# EAGLE schematic firetirs (EAGLE 7.7.0)

## Sheet 1 of 7
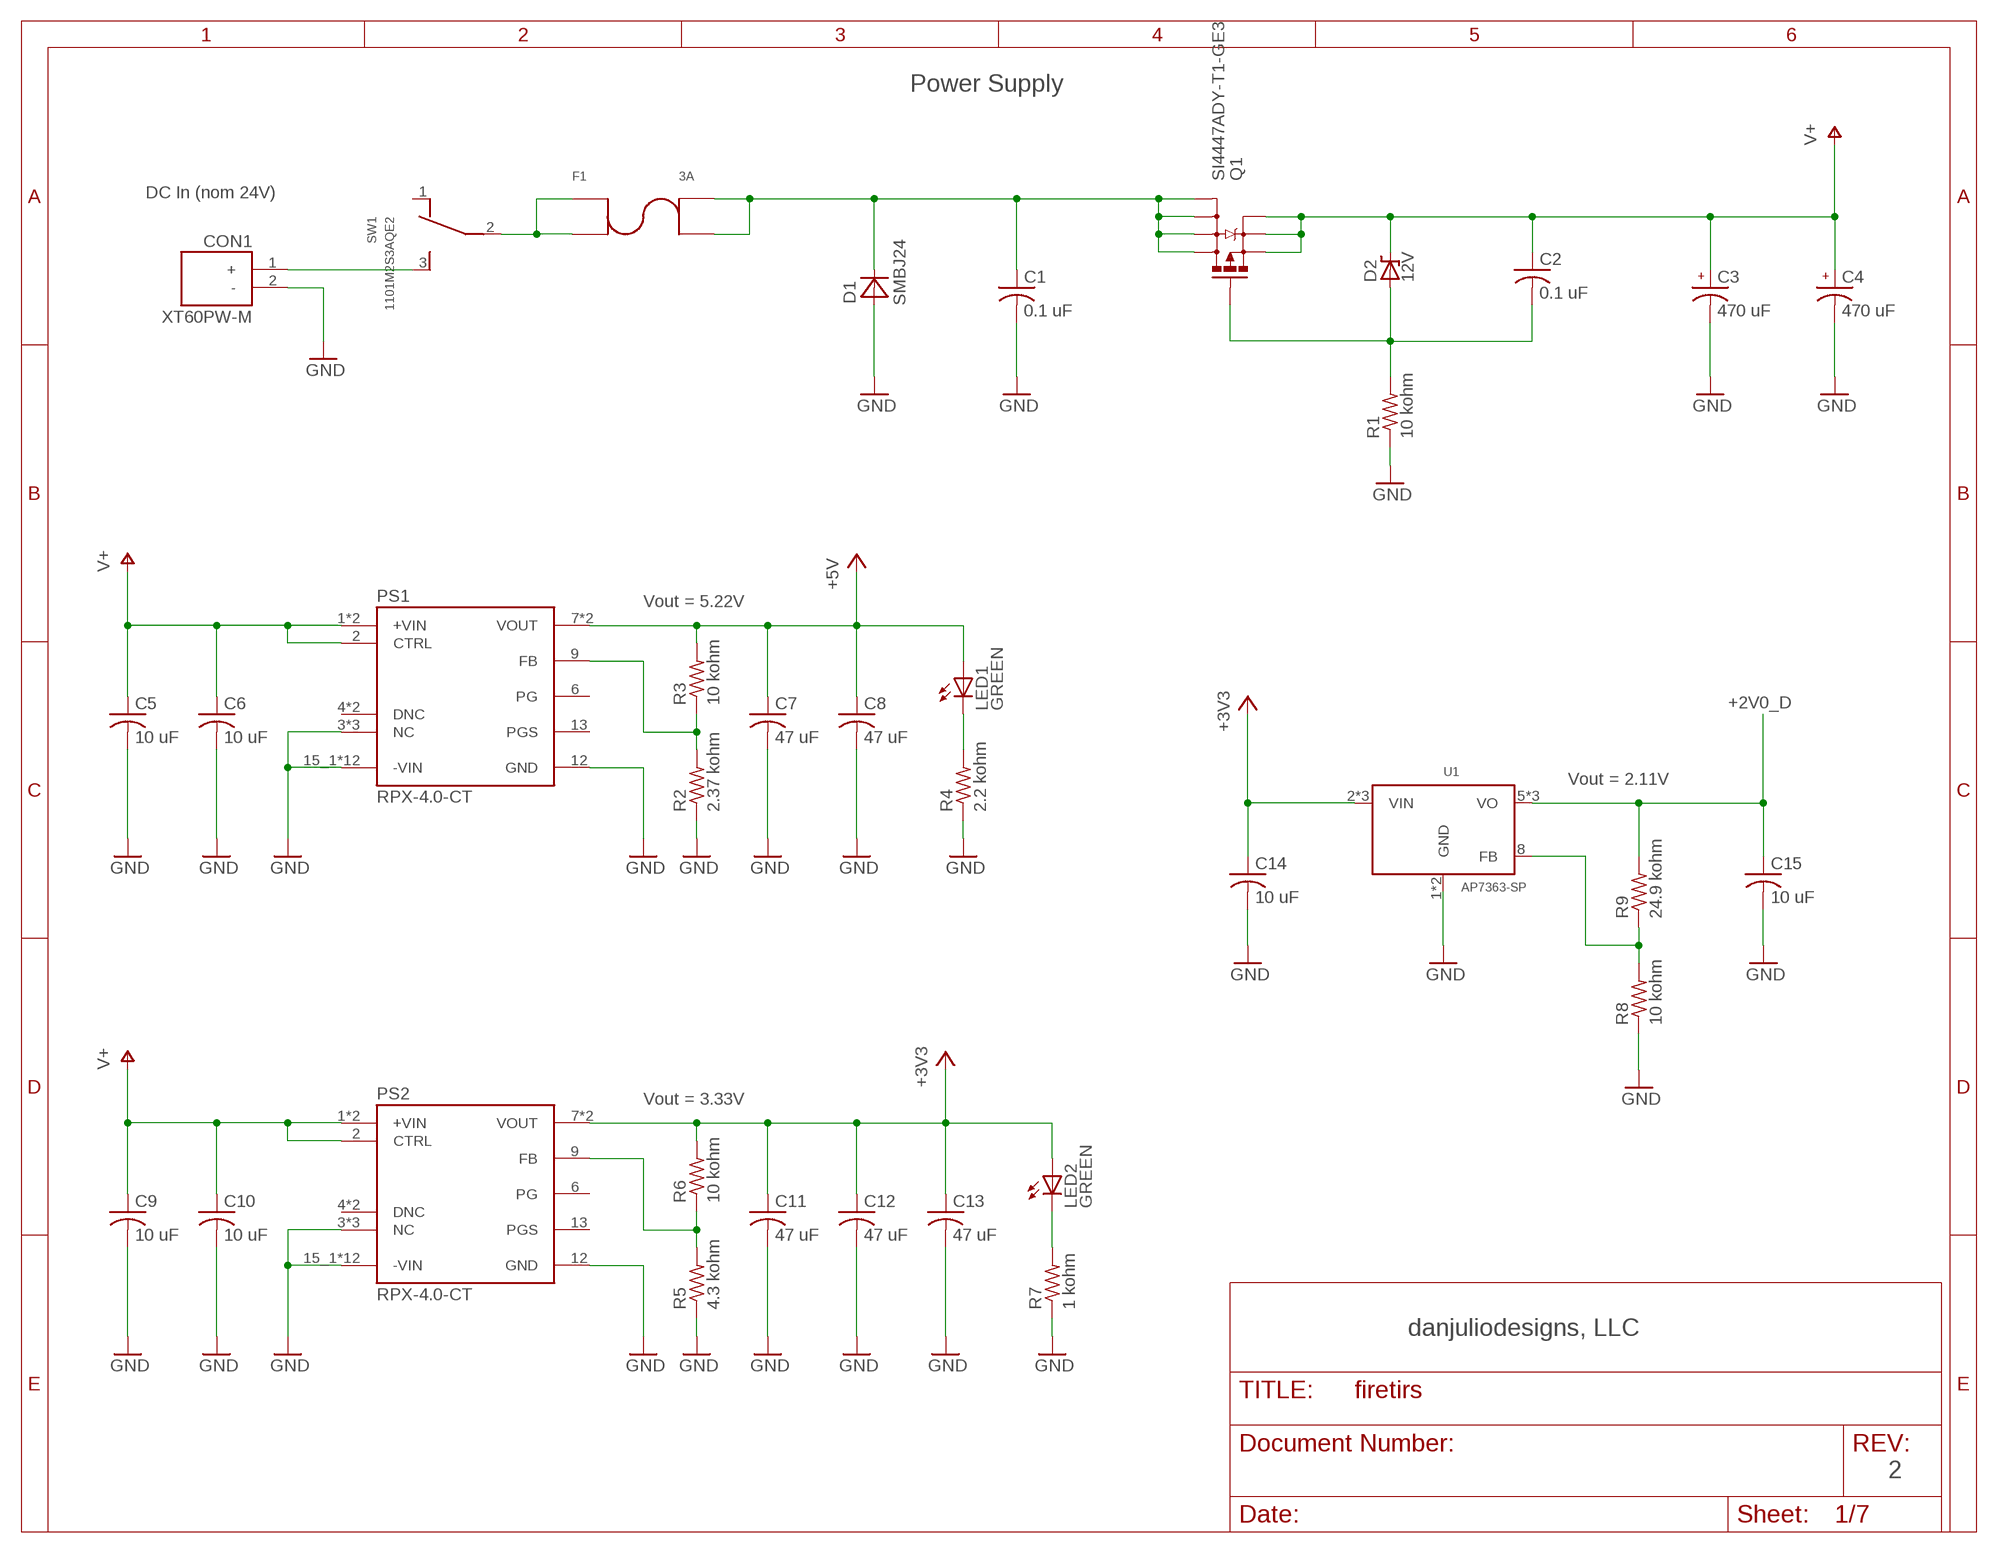
[diagram p0: schematic, sheet 1]

### Parts
C1  0.1 uF  C-USSMT0805  [C0805]
C2  0.1 uF  C-USSMT0805  [C0805]
C3  470 uF  CPOL-USSMT08X10  [ECAP-0810]
C4  470 uF  CPOL-USSMT08X10  [ECAP-0810]
C5  10 uF  C-USSMT0805  [C0805]
C6  10 uF  C-USSMT0805  [C0805]
C7  47 uF  C-USSMT0805  [C0805]
C8  47 uF  C-USSMT0805  [C0805]
C9  10 uF  C-USSMT0805  [C0805]
C10  10 uF  C-USSMT0805  [C0805]
C11  47 uF  C-USSMT0805  [C0805]
C12  47 uF  C-USSMT0805  [C0805]
C13  47 uF  C-USSMT0805  [C0805]
C14  10 uF  C-USSMT0603  [C0603]
C15  10 uF  C-USSMT0603  [C0603]
CON1  XT60PW-M  [AMASS_XT60PW-M]
D1  SMBJ24  DIODESMT214AA  [DO214AA]
D2  12V  ZENER_DIODESOD123  [SOD123]
F1  3A  FUSE_2IO5X20_SIDE  [FUSE_5_20_MM_SIDE]
LED1  GREEN  LEDCHIPLED_0603  [CHIPLED_0603]
LED2  GREEN  LEDCHIPLED_0603  [CHIPLED_0603]
PS1  RPX-4.0-CT  [CONV_RPX-4.0-CT]
PS2  RPX-4.0-CT  [CONV_RPX-4.0-CT]
Q1  SI4447ADY-T1-GE3  MOSFET_PCHANNEL_SO8SO8  [SO8]
R1  10 kohm  R-USSMT0603  [R0603]
R2  2.37 kohm  R-USSMT0603  [R0603]
R3  10 kohm  R-USSMT0603  [R0603]
R4  2.2 kohm  R-USSMT0603  [R0603]
R5  4.3 kohm  R-USSMT0603  [R0603]
R6  10 kohm  R-USSMT0603  [R0603]
R7  1 kohm  R-USSMT0603  [R0603]
R8  10 kohm  R-USSMT0603  [R0603]
R9  24.9 kohm  R-USSMT0603  [R0603]
SW1  1101M2S3AQE2  SPDTSIDE_TH_PWR  [SIDE_PWR_SPDT]
U1  AP7363-SP  AP7363SP  [SO8_PAD]

### Nets
+2V0_D: C15.1 R9.2 U1.5(VO) U1.6(VO) U1.7(VO) ; also sheet 4
+3V3: C11.1 C12.1 C13.1 C14.1 LED2.A PS2.7(VOUT) PS2.8(VOUT) R6.2 U1.2(VIN) U1.3(VIN) U1.4(VIN) ; also sheet 4,5,6,7
+5V: C7.1 C8.1 LED1.A PS1.7(VOUT) PS1.8(VOUT) R3.2 ; also sheet 2,3,7
GND: C1.2 C3.- C4.- C5.2 C6.2 C7.2 C8.2 C9.2 C10.2 C11.2 C12.2 C13.2 C14.2 C15.2 CON1.2(-) D1.A PS1.3(NC) PS1.10(NC) PS1.11(NC) PS1.12(GND) PS1.15_1(-VIN) PS1.15_2(-VIN) PS1.15_3(-VIN) PS1.15_4(-VIN) PS1.15_5(-VIN) PS1.15_6(-VIN) PS1.15_7(-VIN) PS1.15_8(-VIN) PS1.15_9(-VIN) PS1.15_10(-VIN) PS1.15_11(-VIN) PS1.15_12(-VIN) PS2.3(NC) PS2.10(NC) PS2.11(NC) PS2.12(GND) PS2.15_1(-VIN) PS2.15_2(-VIN) PS2.15_3(-VIN) PS2.15_4(-VIN) PS2.15_5(-VIN) PS2.15_6(-VIN) PS2.15_7(-VIN) PS2.15_8(-VIN) PS2.15_9(-VIN) PS2.15_10(-VIN) PS2.15_11(-VIN) PS2.15_12(-VIN) R1.1 R2.1 R4.1 R5.1 R7.1 R8.1 U1.1(GND) U1.PAD(GND) ; also sheet 2,3,4,5,6,7
N$1: CON1.1(+) SW1.3
N$2: F1.1A F1.1B SW1.2
N$3: C1.1 D1.C F1.2A F1.2B Q1.5(D1) Q1.6(D2) Q1.7(D3) Q1.8(D4)
N$4: C2.2 D2.A Q1.4(G) R1.2
N$5: LED1.C R4.2
N$6: LED2.C R7.2
N$7: PS1.9(FB) R2.2 R3.1
N$9: R8.2 R9.1 U1.8(FB)
N$10: PS2.9(FB) R5.2 R6.1
V+: C2.1 C3.+ C4.+ C5.1 C6.1 C9.1 C10.1 D2.C PS1.1(+VIN) PS1.2(CTRL) PS1.14(+VIN) PS2.1(+VIN) PS2.2(CTRL) PS2.14(+VIN) Q1.1(S1) Q1.2(S2) Q1.3(S3)
Unconnected: PS1.4(DNC) PS1.5(DNC) PS1.6(PG) PS1.13(PGS) PS2.4(DNC) PS2.5(DNC) PS2.6(PG) PS2.13(PGS) SW1.1

### Notes on the sheet
- Power Supply
- DC In (nom 24V)
- Vout = 5.22V
- Vout = 2.11V
- Vout = 3.33V
- danjuliodesigns, LLC
- 2

## Sheet 2 of 7
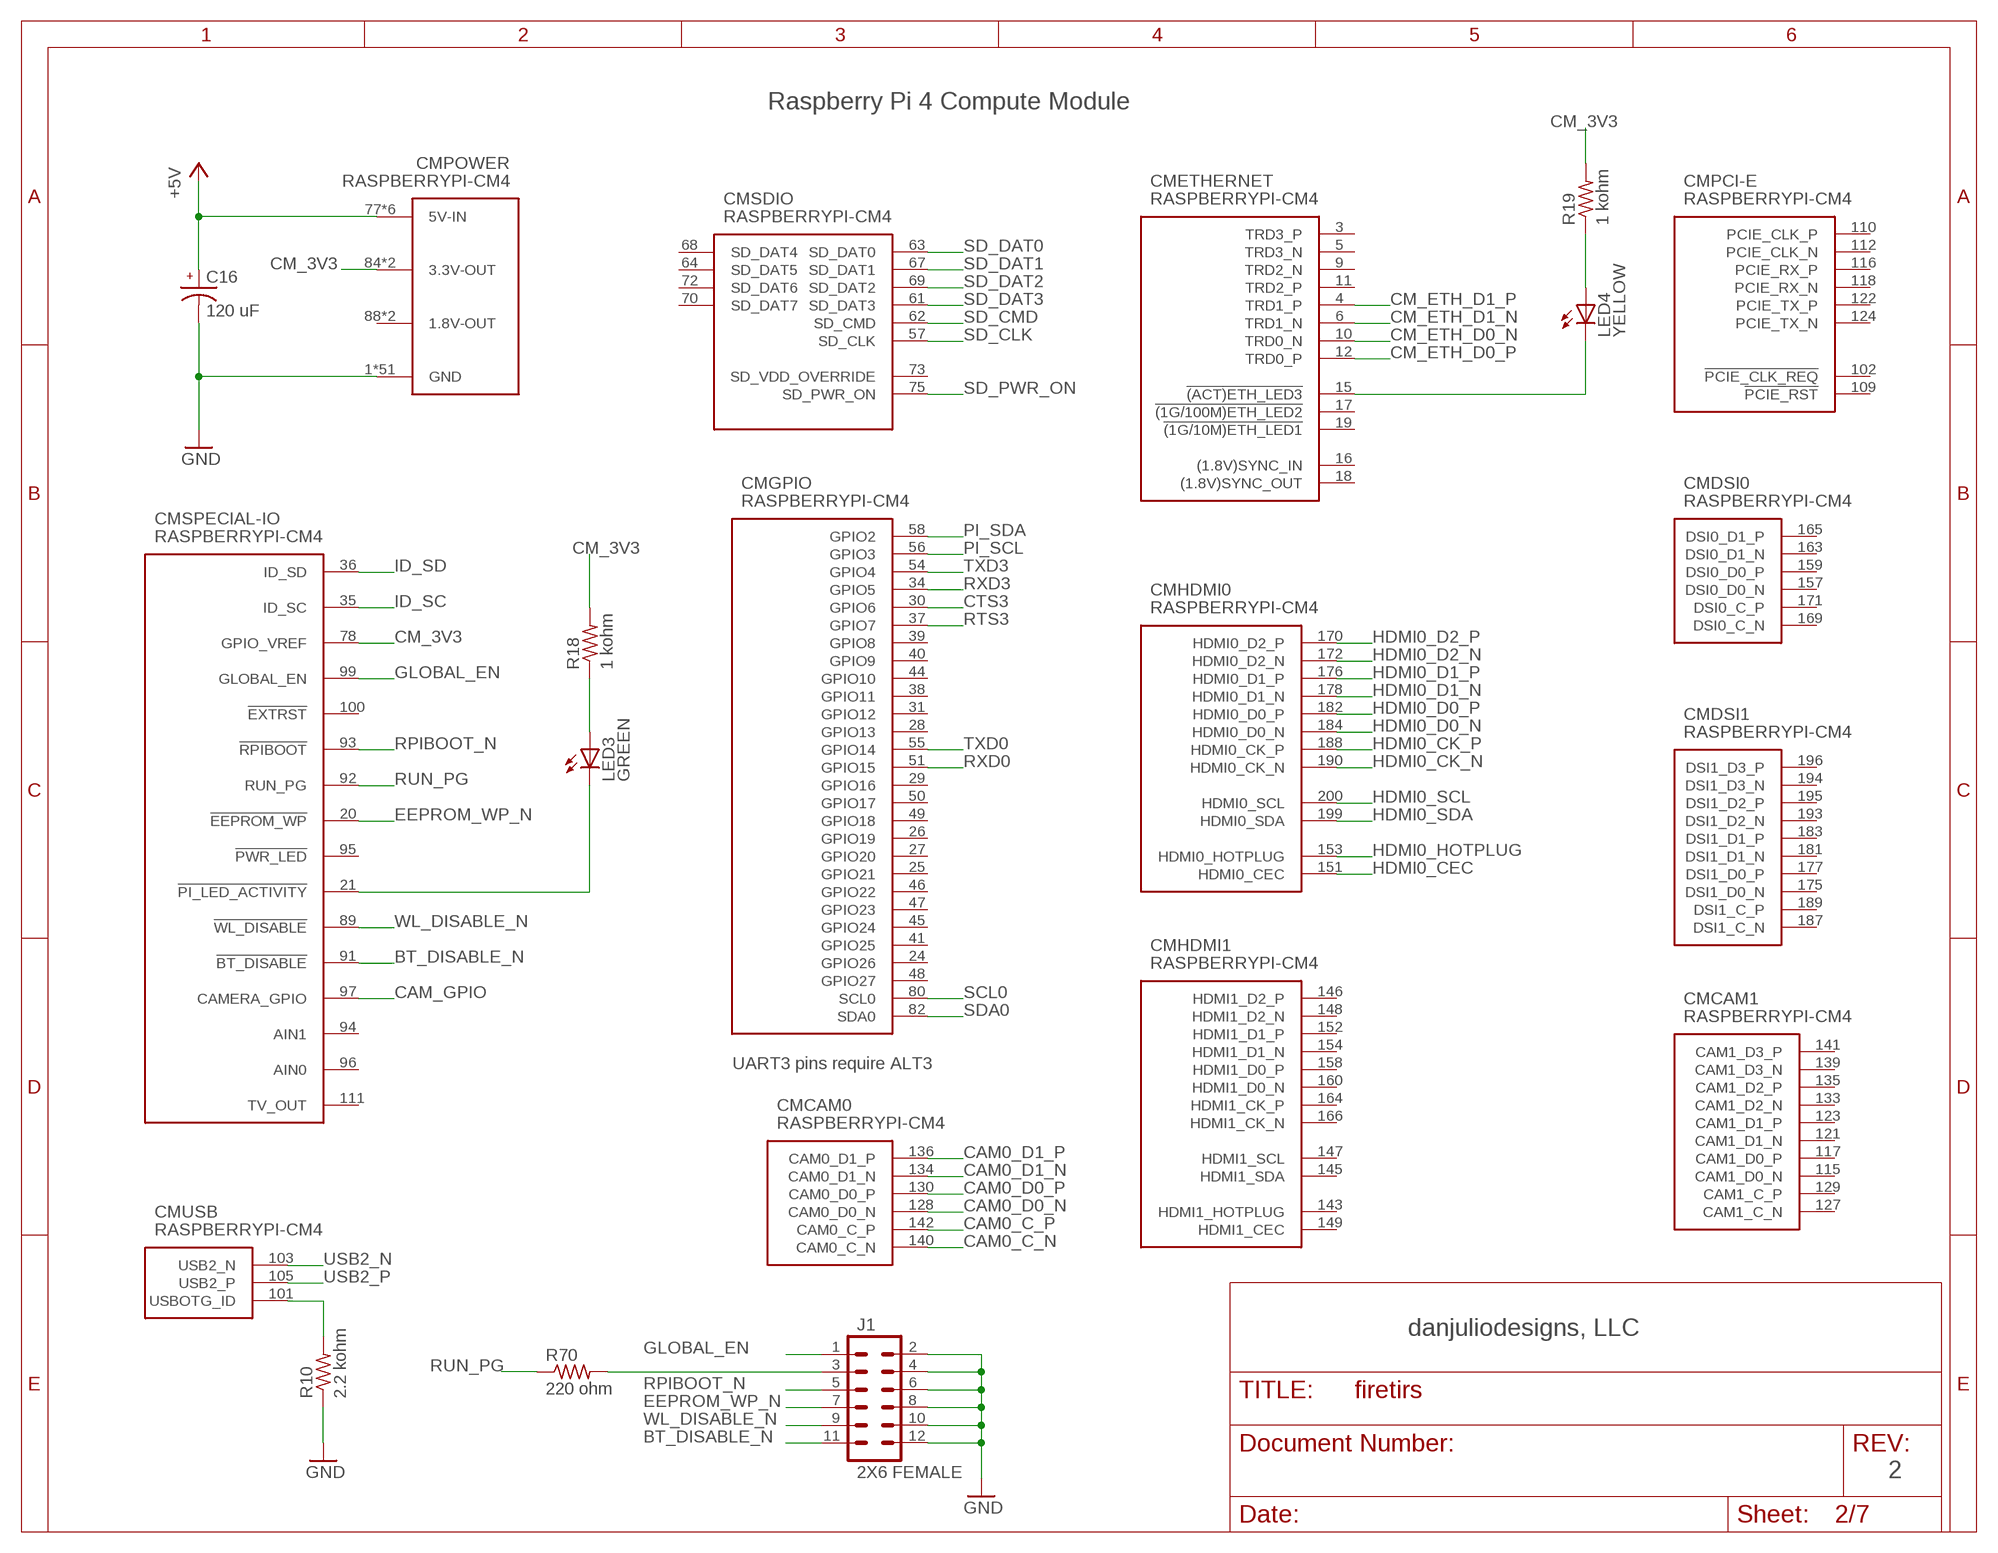
[diagram p1: schematic, sheet 2]

### Parts
C16  120 uF  CPOL-USSMT06X06  [ECAP-0606]
CM  RASPBERRYPI-CM4  [RASPBERRYPI-CM4]
J1  2X6 FEMALE  M06X2PTH_FEMALE  [2X6]
LED3  GREEN  LEDCHIPLED_0603  [CHIPLED_0603]
LED4  YELLOW  LEDCHIPLED_0603  [CHIPLED_0603]
R10  2.2 kohm  R-USSMT0603  [R0603]
R18  1 kohm  R-USSMT0603  [R0603]
R19  1 kohm  R-USSMT0603  [R0603]
R70  220 ohm  R-USSMT0603  [R0603]

### Nets
+5V: C16.+ CM.77(POWER:5V-IN) CM.79(POWER:5V-IN) CM.81(POWER:5V-IN) CM.83(POWER:5V-IN) CM.85(POWER:5V-IN) CM.87(POWER:5V-IN) ; also sheet 1,3,7
BT_DISABLE_N: CM.91(SPECIAL-IO:!BT_DISABLE) J1.11
CAM0_C_N: CM.140(CAM0:CAM0_C_N) ; also sheet 3
CAM0_C_P: CM.142(CAM0:CAM0_C_P) ; also sheet 3
CAM0_D0_N: CM.128(CAM0:CAM0_D0_N) ; also sheet 3
CAM0_D0_P: CM.130(CAM0:CAM0_D0_P) ; also sheet 3
CAM0_D1_N: CM.134(CAM0:CAM0_D1_N) ; also sheet 3
CAM0_D1_P: CM.136(CAM0:CAM0_D1_P) ; also sheet 3
CAM_GPIO: CM.97(SPECIAL-IO:CAMERA_GPIO) ; also sheet 3
CM_3V3: CM.78(SPECIAL-IO:GPIO_VREF) CM.84(POWER:3.3V-OUT) CM.86(POWER:3.3V-OUT) R18.2 R19.2 ; also sheet 3
CM_ETH_D0_N: CM.10(ETHERNET:TRD0_N) ; also sheet 7
CM_ETH_D0_P: CM.12(ETHERNET:TRD0_P) ; also sheet 7
CM_ETH_D1_N: CM.6(ETHERNET:TRD1_N) ; also sheet 7
CM_ETH_D1_P: CM.4(ETHERNET:TRD1_P) ; also sheet 7
CTS3: CM.30(GPIO:GPIO6) ; also sheet 3
EEPROM_WP_N: CM.20(SPECIAL-IO:!EEPROM_WP) J1.7
GLOBAL_EN: CM.99(SPECIAL-IO:GLOBAL_EN) J1.1
GND: C16.- CM.1(POWER:GND) CM.2(POWER:GND) CM.7(POWER:GND) CM.8(POWER:GND) CM.13(POWER:GND) CM.14(POWER:GND) CM.22(POWER:GND) CM.23(POWER:GND) CM.32(POWER:GND) CM.33(POWER:GND) CM.42(POWER:GND) CM.43(POWER:GND) CM.52(POWER:GND) CM.53(POWER:GND) CM.59(POWER:GND) CM.60(POWER:GND) CM.65(POWER:GND) CM.66(POWER:GND) CM.71(POWER:GND) CM.74(POWER:GND) CM.98(POWER:GND) CM.107(POWER:GND) CM.108(POWER:GND) CM.113(POWER:GND) CM.114(POWER:GND) CM.119(POWER:GND) CM.120(POWER:GND) CM.125(POWER:GND) CM.126(POWER:GND) CM.131(POWER:GND) CM.132(POWER:GND) CM.137(POWER:GND) CM.138(POWER:GND) CM.144(POWER:GND) CM.150(POWER:GND) CM.155(POWER:GND) CM.156(POWER:GND) CM.161(POWER:GND) CM.162(POWER:GND) CM.167(POWER:GND) CM.168(POWER:GND) CM.173(POWER:GND) CM.174(POWER:GND) CM.179(POWER:GND) CM.180(POWER:GND) CM.185(POWER:GND) CM.186(POWER:GND) CM.191(POWER:GND) CM.192(POWER:GND) CM.197(POWER:GND) CM.198(POWER:GND) J1.2 J1.4 J1.6 J1.8 J1.10 J1.12 R10.1 ; also sheet 1,3,4,5,6,7
HDMI0_CEC: CM.151(HDMI0:HDMI0_CEC) ; also sheet 3
HDMI0_CK_N: CM.190(HDMI0:HDMI0_CK_N) ; also sheet 3
HDMI0_CK_P: CM.188(HDMI0:HDMI0_CK_P) ; also sheet 3
HDMI0_D0_N: CM.184(HDMI0:HDMI0_D0_N) ; also sheet 3
HDMI0_D0_P: CM.182(HDMI0:HDMI0_D0_P) ; also sheet 3
HDMI0_D1_N: CM.178(HDMI0:HDMI0_D1_N) ; also sheet 3
HDMI0_D1_P: CM.176(HDMI0:HDMI0_D1_P) ; also sheet 3
HDMI0_D2_N: CM.172(HDMI0:HDMI0_D2_N) ; also sheet 3
HDMI0_D2_P: CM.170(HDMI0:HDMI0_D2_P) ; also sheet 3
HDMI0_HOTPLUG: CM.153(HDMI0:HDMI0_HOTPLUG) ; also sheet 3
HDMI0_SCL: CM.200(HDMI0:HDMI0_SCL) ; also sheet 3
HDMI0_SDA: CM.199(HDMI0:HDMI0_SDA) ; also sheet 3
ID_SC: CM.35(SPECIAL-IO:ID_SC) ; also sheet 3
ID_SD: CM.36(SPECIAL-IO:ID_SD) ; also sheet 3
N$8: CM.101(USB:USBOTG_ID) R10.2
N$16: CM.21(SPECIAL-IO:!PI_LED_ACTIVITY) LED3.C
N$19: LED3.A R18.1
N$21: CM.15(ETHERNET:!(ACT)ETH_LED3) LED4.C
N$22: LED4.A R19.1
N$35: J1.3 R70.2
PI_SCL: CM.56(GPIO:GPIO3) ; also sheet 3
PI_SDA: CM.58(GPIO:GPIO2) ; also sheet 3
RPIBOOT_N: CM.93(SPECIAL-IO:!RPIBOOT) J1.5
RTS3: CM.37(GPIO:GPIO7) ; also sheet 3
RUN_PG: CM.92(SPECIAL-IO:RUN_PG) R70.1
RXD0: CM.51(GPIO:GPIO15) ; also sheet 3
RXD3: CM.34(GPIO:GPIO5) ; also sheet 3
SCL0: CM.80(GPIO:SCL0) ; also sheet 3
SD_CLK: CM.57(SDIO:SD_CLK) ; also sheet 3
SD_CMD: CM.62(SDIO:SD_CMD) ; also sheet 3
SD_DAT0: CM.63(SDIO:SD_DAT0) ; also sheet 3
SD_DAT1: CM.67(SDIO:SD_DAT1) ; also sheet 3
SD_DAT2: CM.69(SDIO:SD_DAT2) ; also sheet 3
SD_DAT3: CM.61(SDIO:SD_DAT3) ; also sheet 3
SD_PWR_ON: CM.75(SDIO:SD_PWR_ON) ; also sheet 3
SDA0: CM.82(GPIO:SDA0) ; also sheet 3
TXD0: CM.55(GPIO:GPIO14) ; also sheet 3
TXD3: CM.54(GPIO:GPIO4) ; also sheet 3
USB2_N: CM.103(USB:USB2_N) ; also sheet 3
USB2_P: CM.105(USB:USB2_P) ; also sheet 3
WL_DISABLE_N: CM.89(SPECIAL-IO:!WL_DISABLE) J1.9
Unconnected: CM.3(ETHERNET:TRD3_P) CM.5(ETHERNET:TRD3_N) CM.9(ETHERNET:TRD2_N) CM.11(ETHERNET:TRD2_P) CM.16(ETHERNET:(1.8V)SYNC_IN) CM.17(ETHERNET:!(1G/100M)ETH_LED2) CM.18(ETHERNET:(1.8V)SYNC_OUT) CM.19(ETHERNET:!(1G/10M)ETH_LED1) CM.24(GPIO:GPIO26) CM.25(GPIO:GPIO21) CM.26(GPIO:GPIO19) CM.27(GPIO:GPIO20) CM.28(GPIO:GPIO13) CM.29(GPIO:GPIO16) CM.31(GPIO:GPIO12) CM.38(GPIO:GPIO11) CM.39(GPIO:GPIO8) CM.40(GPIO:GPIO9) CM.41(GPIO:GPIO25) CM.44(GPIO:GPIO10) CM.45(GPIO:GPIO24) CM.46(GPIO:GPIO22) CM.47(GPIO:GPIO23) CM.48(GPIO:GPIO27) CM.49(GPIO:GPIO18) CM.50(GPIO:GPIO17) CM.64(SDIO:SD_DAT5) CM.68(SDIO:SD_DAT4) CM.70(SDIO:SD_DAT7) CM.72(SDIO:SD_DAT6) CM.73(SDIO:SD_VDD_OVERRIDE) CM.94(SPECIAL-IO:AIN1) CM.95(SPECIAL-IO:!PWR_LED) CM.96(SPECIAL-IO:AIN0) CM.100(SPECIAL-IO:!EXTRST) CM.102(PCI-E:!PCIE_CLK_REQ) CM.109(PCI-E:!PCIE_RST) CM.110(PCI-E:PCIE_CLK_P) CM.111(SPECIAL-IO:TV_OUT) CM.112(PCI-E:PCIE_CLK_N) CM.115(CAM1:CAM1_D0_N) CM.116(PCI-E:PCIE_RX_P) CM.117(CAM1:CAM1_D0_P) CM.118(PCI-E:PCIE_RX_N) CM.121(CAM1:CAM1_D1_N) CM.122(PCI-E:PCIE_TX_P) CM.123(CAM1:CAM1_D1_P) CM.124(PCI-E:PCIE_TX_N) CM.127(CAM1:CAM1_C_N) CM.129(CAM1:CAM1_C_P) CM.133(CAM1:CAM1_D2_N) CM.135(CAM1:CAM1_D2_P) CM.139(CAM1:CAM1_D3_N) CM.141(CAM1:CAM1_D3_P) CM.143(HDMI1:HDMI1_HOTPLUG) CM.145(HDMI1:HDMI1_SDA) CM.146(HDMI1:HDMI1_D2_P) CM.147(HDMI1:HDMI1_SCL) CM.148(HDMI1:HDMI1_D2_N) CM.149(HDMI1:HDMI1_CEC) CM.152(HDMI1:HDMI1_D1_P) CM.154(HDMI1:HDMI1_D1_N) CM.157(DSI0:DSI0_D0_N) CM.158(HDMI1:HDMI1_D0_P) CM.159(DSI0:DSI0_D0_P) CM.160(HDMI1:HDMI1_D0_N) CM.163(DSI0:DSI0_D1_N) CM.164(HDMI1:HDMI1_CK_P) CM.165(DSI0:DSI0_D1_P) CM.166(HDMI1:HDMI1_CK_N) CM.169(DSI0:DSI0_C_N) CM.171(DSI0:DSI0_C_P) CM.175(DSI1:DSI1_D0_N) CM.177(DSI1:DSI1_D0_P) CM.181(DSI1:DSI1_D1_N) CM.183(DSI1:DSI1_D1_P) CM.187(DSI1:DSI1_C_N) CM.189(DSI1:DSI1_C_P) CM.193(DSI1:DSI1_D2_N) CM.194(DSI1:DSI1_D3_N) CM.195(DSI1:DSI1_D2_P) CM.196(DSI1:DSI1_D3_P)

### Notes on the sheet
- Raspberry Pi 4 Compute Module
- UART3 pins require ALT3
- danjuliodesigns, LLC
- 2

## Sheet 3 of 7
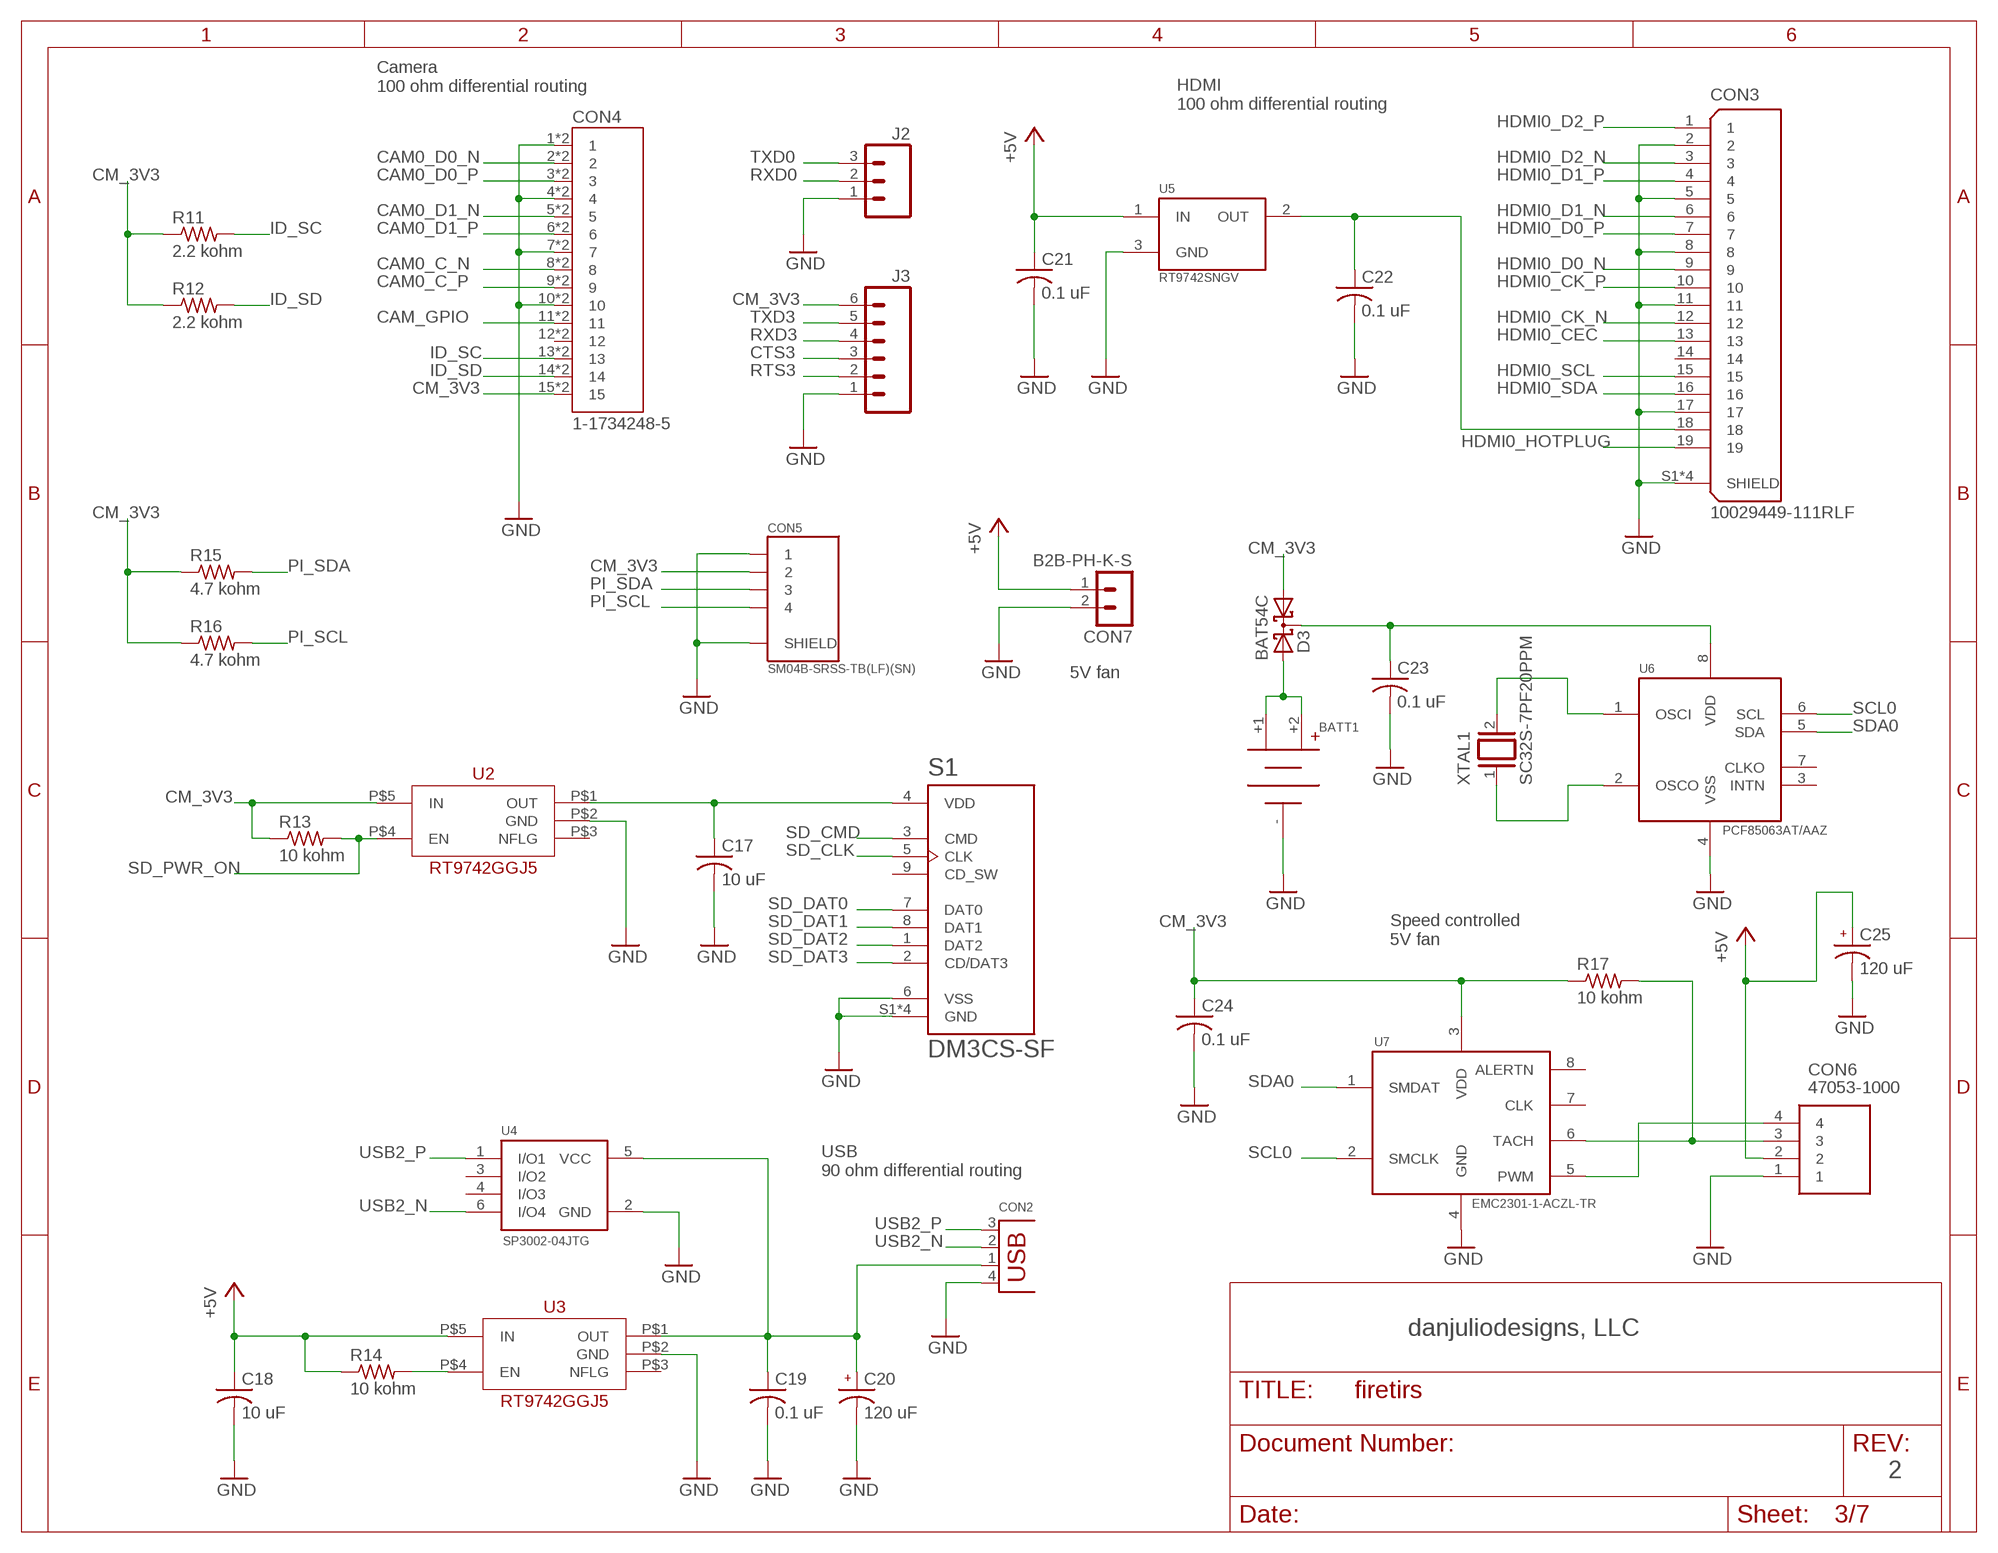
[diagram p2: schematic, sheet 3]

### Parts
BATT1  COIN_CELL12MM  [KEYSTONE_3001]
C17  10 uF  C-USSMT0603  [C0603]
C18  10 uF  C-USSMT0603  [C0603]
C19  0.1 uF  C-USSMT0603  [C0603]
C20  120 uF  CPOL-USSMT06X06  [ECAP-0606]
C21  0.1 uF  C-USSMT0603  [C0603]
C22  0.1 uF  C-USSMT0603  [C0603]
C23  0.1 uF  C-USSMT0603  [C0603]
C24  0.1 uF  C-USSMT0603  [C0603]
C25  120 uF  CPOL-USSMT06X06  [ECAP-0606]
CON2  USBFCI_87520  [FCI_87520]
CON3  10029449-111RLF  [AMPHENOL_10029449-111RLF]
CON4  1-1734248-5  [TE_1-1734248-5]
CON5  SM04B-SRSS-TB(LF)(SN)  [JST_SM04B-SRSS-TB(LF)(SN)]
CON6  47053-1000  [470531000]
CON7  B2B-PH-K-S  [B2B-PH-K-S]
D3  BAT54C  [SOT23]
J2  M03PTH  [1X03]
J3  M06SILK_FEMALE_PTH  [1X06]
R11  2.2 kohm  R-USSMT0603  [R0603]
R12  2.2 kohm  R-USSMT0603  [R0603]
R13  10 kohm  R-USSMT0603  [R0603]
R14  10 kohm  R-USSMT0603  [R0603]
R15  4.7 kohm  R-USSMT0603  [R0603]
R16  4.7 kohm  R-USSMT0603  [R0603]
R17  10 kohm  R-USSMT0603  [R0603]
S1  DM3CS-SF  [HRS_DM3CS-SF]
U2  RT9742GGJ5  [TSOT-23-5]
U3  RT9742GGJ5  [TSOT-23-5]
U4  SP3002-04JTG  [SOT65P220X95-6N]
U5  RT9742SNGV  RT9742_3TERMGV  [SOT23-3]
U6  PCF85063AT/AAZ  PCF85063AT  [SO8]
U7  EMC2301-1-ACZL-TR  EMC2301  [MSOP8]
XTAL1  SC32S-7PF20PPM  CRYSTAL3.2X1.5  [CRYSTAL-3215]

### Nets
+5V: C18.1 C21.1 C25.+ CON6.2 CON7.1 R14.1 U3.P$5(IN) U5.1(IN) ; also sheet 1,2,7
CAM0_C_N: CON4.8 CON4.8_1 ; also sheet 2
CAM0_C_P: CON4.9 CON4.9_1 ; also sheet 2
CAM0_D0_N: CON4.2 CON4.2_1 ; also sheet 2
CAM0_D0_P: CON4.3 CON4.3_1 ; also sheet 2
CAM0_D1_N: CON4.5 CON4.5_1 ; also sheet 2
CAM0_D1_P: CON4.6 CON4.6_1 ; also sheet 2
CAM_GPIO: CON4.11 CON4.11_1 ; also sheet 2
CM_3V3: C24.1 CON4.15 CON4.15_1 CON5.2 D3.1(A1) J3.6 R11.1 R12.1 R13.1 R15.1 R16.1 R17.1 U2.P$5(IN) U7.3(VDD) ; also sheet 2
CTS3: J3.3 ; also sheet 2
GND: BATT1.- C17.2 C18.2 C19.2 C20.- C21.2 C22.2 C23.2 C24.2 C25.- CON2.4(GND) CON3.2 CON3.5 CON3.8 CON3.11 CON3.17 CON3.S1(SHIELD) CON3.S2(SHIELD) CON3.S3(SHIELD) CON3.S4(SHIELD) CON4.1 CON4.1_1 CON4.4 CON4.4_1 CON4.7 CON4.7_1 CON4.10 CON4.10_1 CON5.1 CON5.S1(SHIELD) CON5.S2(SHIELD) CON6.1 CON7.2 J2.1 J3.1 S1.6(VSS) S1.S1(GND) S1.S2(GND) S1.S3(GND) S1.S5(GND) U2.P$2(GND) U3.P$2(GND) U4.2(GND) U5.3(GND) U6.4(VSS) U7.4(GND) ; also sheet 1,2,4,5,6,7
HDMI0_CEC: CON3.13 ; also sheet 2
HDMI0_CK_N: CON3.12 ; also sheet 2
HDMI0_CK_P: CON3.10 ; also sheet 2
HDMI0_D0_N: CON3.9 ; also sheet 2
HDMI0_D0_P: CON3.7 ; also sheet 2
HDMI0_D1_N: CON3.6 ; also sheet 2
HDMI0_D1_P: CON3.4 ; also sheet 2
HDMI0_D2_N: CON3.3 ; also sheet 2
HDMI0_D2_P: CON3.1 ; also sheet 2
HDMI0_HOTPLUG: CON3.19 ; also sheet 2
HDMI0_SCL: CON3.15 ; also sheet 2
HDMI0_SDA: CON3.16 ; also sheet 2
ID_SC: CON4.13 CON4.13_1 R11.2 ; also sheet 2
ID_SD: CON4.14 CON4.14_1 R12.2 ; also sheet 2
N$11: C17.1 S1.4(VDD) U2.P$1(OUT)
N$12: C19.1 C20.+ CON2.1(VBUS) U3.P$1(OUT) U4.5(VCC)
N$13: U6.2(OSCO) XTAL1.1
N$14: BATT1.+1 BATT1.+2 D3.2(A2)
N$15: U6.1(OSCI) XTAL1.2
N$17: CON6.3 R17.2 U7.6(TACH)
N$18: CON6.4 U7.5(PWM)
N$20: R14.2 U3.P$4(EN)
OUT: C22.1 CON3.18 U5.2(OUT)
PI_SCL: CON5.4 R16.2 ; also sheet 2
PI_SDA: CON5.3 R15.2 ; also sheet 2
RTS3: J3.2 ; also sheet 2
RXD0: J2.2 ; also sheet 2
RXD3: J3.4 ; also sheet 2
SCL0: U6.6(SCL) U7.2(SMCLK) ; also sheet 2
SD_CLK: S1.5(CLK) ; also sheet 2
SD_CMD: S1.3(CMD) ; also sheet 2
SD_DAT0: S1.7(DAT0) ; also sheet 2
SD_DAT1: S1.8(DAT1) ; also sheet 2
SD_DAT2: S1.1(DAT2) ; also sheet 2
SD_DAT3: S1.2(CD/DAT3) ; also sheet 2
SD_PWR_ON: R13.2 U2.P$4(EN) ; also sheet 2
SDA0: U6.5(SDA) U7.1(SMDAT) ; also sheet 2
TXD0: J2.3 ; also sheet 2
TXD3: J3.5 ; also sheet 2
USB2_N: CON2.2(D-) U4.6(I/O4) ; also sheet 2
USB2_P: CON2.3(D+) U4.1(I/O1) ; also sheet 2
VDD: C23.1 D3.3(CC) U6.8(VDD)
Unconnected: CON3.14 CON4.12 CON4.12_1 S1.9(CD_SW) U2.P$3(NFLG) U3.P$3(NFLG) U4.3(I/O2) U4.4(I/O3) U6.3(INTN) U6.7(CLKO) U7.7(CLK) U7.8(ALERTN)

### Notes on the sheet
- Camera
  100 ohm differential routing
- HDMI
  100 ohm differential routing
- 5V fan
- Speed controlled
  5V fan
- USB
  90 ohm differential routing
- danjuliodesigns, LLC
- 2

## Sheet 4 of 7
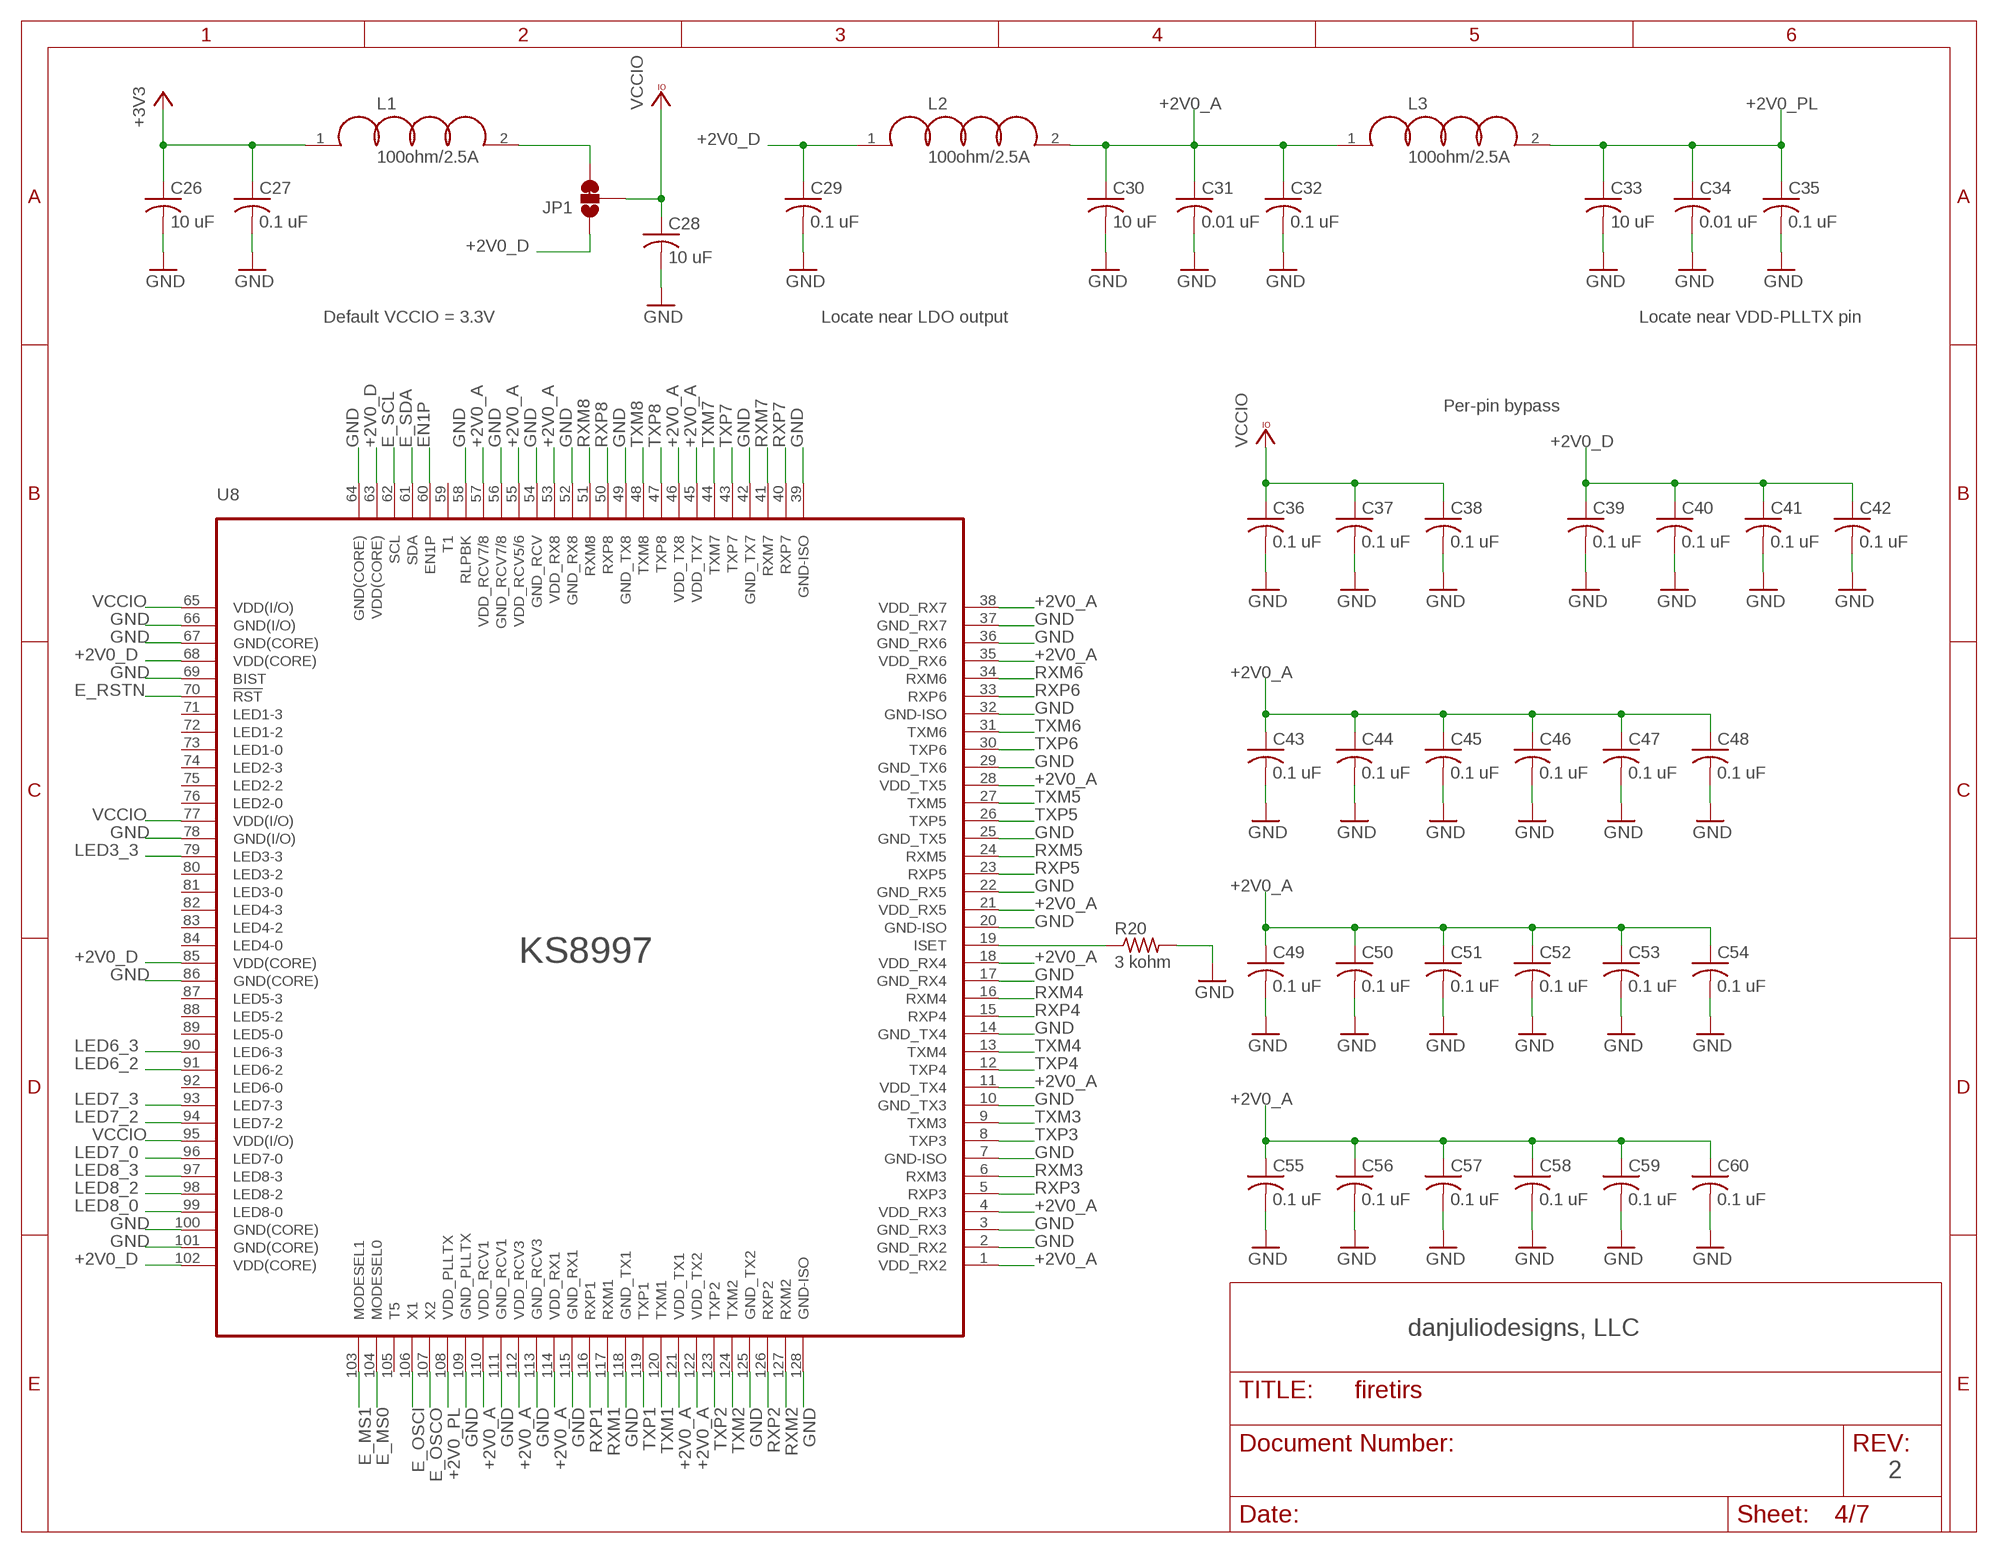
[diagram p3: schematic, sheet 4]

### Parts
C26  10 uF  C-USSMT0603  [C0603]
C27  0.1 uF  C-USSMT0603  [C0603]
C28  10 uF  C-USSMT0603  [C0603]
C29  0.1 uF  C-USSMT0603  [C0603]
C30  10 uF  C-USSMT0603  [C0603]
C31  0.01 uF  C-USSMT0603  [C0603]
C32  0.1 uF  C-USSMT0603  [C0603]
C33  10 uF  C-USSMT0603  [C0603]
C34  0.01 uF  C-USSMT0603  [C0603]
C35  0.1 uF  C-USSMT0603  [C0603]
C36  0.1 uF  C-USSMT0603  [C0603]
C37  0.1 uF  C-USSMT0603  [C0603]
C38  0.1 uF  C-USSMT0603  [C0603]
C39  0.1 uF  C-USSMT0603  [C0603]
C40  0.1 uF  C-USSMT0603  [C0603]
C41  0.1 uF  C-USSMT0603  [C0603]
C42  0.1 uF  C-USSMT0603  [C0603]
C43  0.1 uF  C-USSMT0603  [C0603]
C44  0.1 uF  C-USSMT0603  [C0603]
C45  0.1 uF  C-USSMT0603  [C0603]
C46  0.1 uF  C-USSMT0603  [C0603]
C47  0.1 uF  C-USSMT0603  [C0603]
C48  0.1 uF  C-USSMT0603  [C0603]
C49  0.1 uF  C-USSMT0603  [C0603]
C50  0.1 uF  C-USSMT0603  [C0603]
C51  0.1 uF  C-USSMT0603  [C0603]
C52  0.1 uF  C-USSMT0603  [C0603]
C53  0.1 uF  C-USSMT0603  [C0603]
C54  0.1 uF  C-USSMT0603  [C0603]
C55  0.1 uF  C-USSMT0603  [C0603]
C56  0.1 uF  C-USSMT0603  [C0603]
C57  0.1 uF  C-USSMT0603  [C0603]
C58  0.1 uF  C-USSMT0603  [C0603]
C59  0.1 uF  C-USSMT0603  [C0603]
C60  0.1 uF  C-USSMT0603  [C0603]
JP1  JUMPER-PAD-3-2OF3_NC_BY_TRACE_SMALL  [PAD-JUMPER-3-2OF3_NC_BY_TRACE_YES_SILK_FULL_BOX]
L1  100ohm/2.5A  INDUCTORSMT0603  [L0603]
L2  100ohm/2.5A  INDUCTORSMT0603  [L0603]
L3  100ohm/2.5A  INDUCTORSMT0603  [L0603]
R20  3 kohm  R-USSMT0603  [R0603]
U8  KS8997  [PQFP128-PQ]

### Nets
+2V0_A: C30.1 C31.1 C32.1 C43.1 C44.1 C45.1 C46.1 C47.1 C48.1 C49.1 C50.1 C51.1 C52.1 C53.1 C54.1 C55.1 C56.1 C57.1 C58.1 C59.1 C60.1 L2.2 L3.1 U8.1(VDD_RX2) U8.4(VDD_RX3) U8.11(VDD_TX4) U8.18(VDD_RX4) U8.21(VDD_RX5) U8.28(VDD_TX5) U8.35(VDD_RX6) U8.38(VDD_RX7) U8.45(VDD_TX7) U8.46(VDD_TX8) U8.53(VDD_RX8) U8.55(VDD_RCV5/6) U8.57(VDD_RCV7/8) U8.110(VDD_RCV1) U8.112(VDD_RCV3) U8.114(VDD_RX1) U8.121(VDD_TX1) U8.122(VDD_TX2) ; also sheet 6,7
+2V0_D: C29.1 C39.1 C40.1 C41.1 C42.1 JP1.1 L2.1 U8.63(VDD(CORE)) U8.68(VDD(CORE)) U8.85(VDD(CORE)) U8.102(VDD(CORE)) ; also sheet 1
+2V0_PL: C33.1 C34.1 C35.1 L3.2 U8.108(VDD_PLLTX)
+3V3: C26.1 C27.1 L1.1 ; also sheet 1,5,6,7
E_MS0: U8.104(MODESEL0) ; also sheet 5
E_MS1: U8.103(MODESEL1) ; also sheet 5
E_OSCI: U8.106(X1) ; also sheet 5
E_OSCO: U8.107(X2) ; also sheet 5
E_RSTN: U8.70(!RST!) ; also sheet 5
E_SCL: U8.62(SCL) ; also sheet 5
E_SDA: U8.61(SDA) ; also sheet 5
EN1P: U8.60(EN1P) ; also sheet 5
GND: C26.2 C27.2 C28.2 C29.2 C30.2 C31.2 C32.2 C33.2 C34.2 C35.2 C36.2 C37.2 C38.2 C39.2 C40.2 C41.2 C42.2 C43.2 C44.2 C45.2 C46.2 C47.2 C48.2 C49.2 C50.2 C51.2 C52.2 C53.2 C54.2 C55.2 C56.2 C57.2 C58.2 C59.2 C60.2 R20.2 U8.2(GND_RX2) U8.3(GND_RX3) U8.7(GND-ISO) U8.10(GND_TX3) U8.14(GND_TX4) U8.17(GND_RX4) U8.20(GND-ISO) U8.22(GND_RX5) U8.25(GND_TX5) U8.29(GND_TX6) U8.32(GND-ISO) U8.36(GND_RX6) U8.37(GND_RX7) U8.39(GND-ISO) U8.42(GND_TX7) U8.49(GND_TX8) U8.52(GND_RX8) U8.54(GND_RCV) U8.56(GND_RCV7/8) U8.58(RLPBK) U8.64(GND(CORE)) U8.66(GND(I/O)) U8.67(GND(CORE)) U8.69(BIST) U8.78(GND(I/O)) U8.86(GND(CORE)) U8.100(GND(CORE)) U8.101(GND(CORE)) U8.109(GND_PLLTX) U8.111(GND_RCV1) U8.113(GND_RCV3) U8.115(GND_RX1) U8.118(GND_TX1) U8.125(GND_TX2) U8.128(GND-ISO) ; also sheet 1,2,3,5,6,7
ISET: R20.1 U8.19(ISET)
LED3_3: U8.79(LED3-3) ; also sheet 5
LED6_2: U8.91(LED6-2) ; also sheet 5
LED6_3: U8.90(LED6-3) ; also sheet 5
LED7_0: U8.96(LED7-0) ; also sheet 5
LED7_2: U8.94(LED7-2) ; also sheet 5
LED7_3: U8.93(LED7-3) ; also sheet 5
LED8_0: U8.99(LED8-0) ; also sheet 5
LED8_2: U8.98(LED8-2) ; also sheet 5
LED8_3: U8.97(LED8-3) ; also sheet 5
N$24: JP1.3 L1.2
RXM1: U8.117(RXM1) ; also sheet 7
RXM2: U8.127(RXM2) ; also sheet 7
RXM3: U8.6(RXM3) ; also sheet 7
RXM4: U8.16(RXM4) ; also sheet 6
RXM5: U8.24(RXM5) ; also sheet 6
RXM6: U8.34(RXM6) ; also sheet 6
RXM7: U8.41(RXM7) ; also sheet 6
RXM8: U8.51(RXM8) ; also sheet 7
RXP1: U8.116(RXP1) ; also sheet 7
RXP2: U8.126(RXP2) ; also sheet 7
RXP3: U8.5(RXP3) ; also sheet 7
RXP4: U8.15(RXP4) ; also sheet 6
RXP5: U8.23(RXP5) ; also sheet 6
RXP6: U8.33(RXP6) ; also sheet 6
RXP7: U8.40(RXP7) ; also sheet 6
RXP8: U8.50(RXP8) ; also sheet 7
TXM1: U8.120(TXM1) ; also sheet 7
TXM2: U8.124(TXM2) ; also sheet 7
TXM3: U8.9(TXM3) ; also sheet 7
TXM4: U8.13(TXM4) ; also sheet 6
TXM5: U8.27(TXM5) ; also sheet 6
TXM6: U8.31(TXM6) ; also sheet 6
TXM7: U8.44(TXM7) ; also sheet 6
TXM8: U8.48(TXM8) ; also sheet 7
TXP1: U8.119(TXP1) ; also sheet 7
TXP2: U8.123(TXP2) ; also sheet 7
TXP3: U8.8(TXP3) ; also sheet 7
TXP4: U8.12(TXP4) ; also sheet 6
TXP5: U8.26(TXP5) ; also sheet 6
TXP6: U8.30(TXP6) ; also sheet 6
TXP7: U8.43(TXP7) ; also sheet 6
TXP8: U8.47(TXP8) ; also sheet 7
VCCIO: C28.1 C36.1 C37.1 C38.1 JP1.2 U8.65(VDD(I/O)) U8.77(VDD(I/O)) U8.95(VDD(I/O)) ; also sheet 5
Unconnected: U8.59(T1) U8.71(LED1-3) U8.72(LED1-2) U8.73(LED1-0) U8.74(LED2-3) U8.75(LED2-2) U8.76(LED2-0) U8.80(LED3-2) U8.81(LED3-0) U8.82(LED4-3) U8.83(LED4-2) U8.84(LED4-0) U8.87(LED5-3) U8.88(LED5-2) U8.89(LED5-0) U8.92(LED6-0) U8.105(T5)

### Notes on the sheet
- Default VCCIO = 3.3V | Locate near LDO output | Locate near VDD-PLLTX pin
- Per-pin bypass
- danjuliodesigns, LLC
- 2

## Sheet 5 of 7
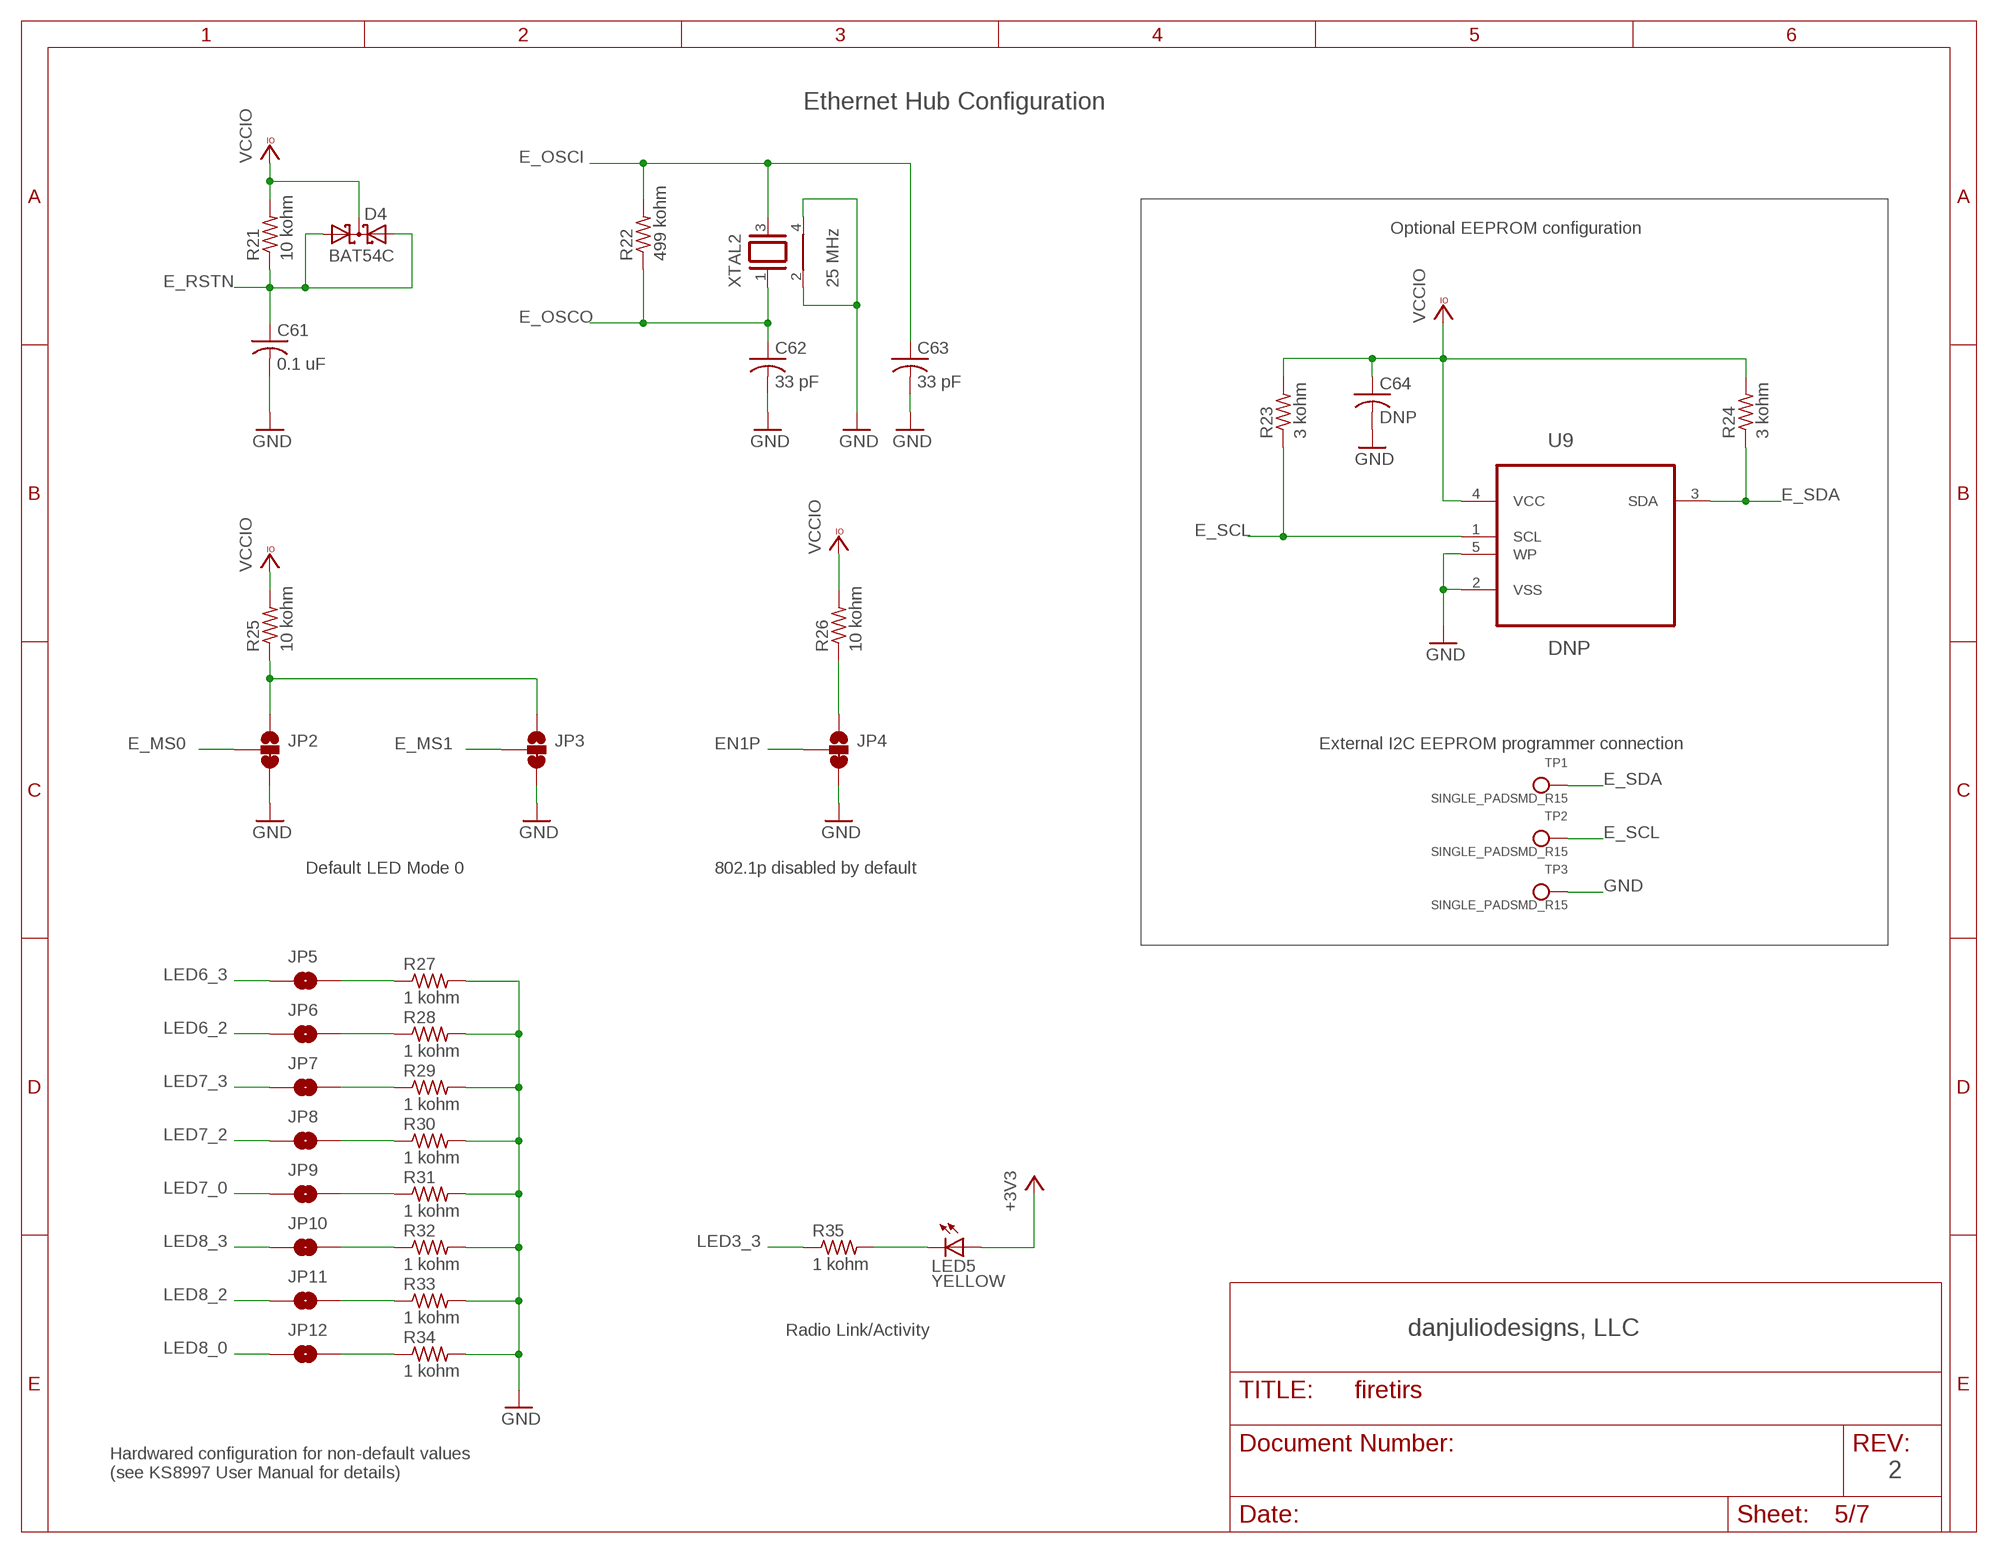
[diagram p4: schematic, sheet 5]

### Parts
C61  0.1 uF  C-USSMT0603  [C0603]
C62  33 pF  C-USSMT0603  [C0603]
C63  33 pF  C-USSMT0603  [C0603]
C64  DNP  C-USSMT0603  [C0603]
D4  BAT54C  [SOT23]
JP2  JUMPER-PAD-3-2OF3_NC_BY_TRACE_SMALL  [PAD-JUMPER-3-2OF3_NC_BY_TRACE_YES_SILK_FULL_BOX]
JP3  JUMPER-PAD-3-2OF3_NC_BY_TRACE_SMALL  [PAD-JUMPER-3-2OF3_NC_BY_TRACE_YES_SILK_FULL_BOX]
JP4  JUMPER-PAD-3-2OF3_NC_BY_TRACE_SMALL  [PAD-JUMPER-3-2OF3_NC_BY_TRACE_YES_SILK_FULL_BOX]
JP5  JUMPER-PAD-2-NOYES_SILK  [PAD-JUMPER-2-NO_YES_SILK]
JP6  JUMPER-PAD-2-NOYES_SILK  [PAD-JUMPER-2-NO_YES_SILK]
JP7  JUMPER-PAD-2-NOYES_SILK  [PAD-JUMPER-2-NO_YES_SILK]
JP8  JUMPER-PAD-2-NOYES_SILK  [PAD-JUMPER-2-NO_YES_SILK]
JP9  JUMPER-PAD-2-NOYES_SILK  [PAD-JUMPER-2-NO_YES_SILK]
JP10  JUMPER-PAD-2-NOYES_SILK  [PAD-JUMPER-2-NO_YES_SILK]
JP11  JUMPER-PAD-2-NOYES_SILK  [PAD-JUMPER-2-NO_YES_SILK]
JP12  JUMPER-PAD-2-NOYES_SILK  [PAD-JUMPER-2-NO_YES_SILK]
LED5  YELLOW  LEDCHIPLED_0603  [CHIPLED_0603]
R21  10 kohm  R-USSMT0603  [R0603]
R22  499 kohm  R-USSMT0603  [R0603]
R23  3 kohm  R-USSMT0603  [R0603]
R24  3 kohm  R-USSMT0603  [R0603]
R25  10 kohm  R-USSMT0603  [R0603]
R26  10 kohm  R-USSMT0603  [R0603]
R27  1 kohm  R-USSMT0603  [R0603]
R28  1 kohm  R-USSMT0603  [R0603]
R29  1 kohm  R-USSMT0603  [R0603]
R30  1 kohm  R-USSMT0603  [R0603]
R31  1 kohm  R-USSMT0603  [R0603]
R32  1 kohm  R-USSMT0603  [R0603]
R33  1 kohm  R-USSMT0603  [R0603]
R34  1 kohm  R-USSMT0603  [R0603]
R35  1 kohm  R-USSMT0603  [R0603]
TP1  SINGLE_PADSMD_R15  [1_5MM_R_SMD_PAD]
TP2  SINGLE_PADSMD_R15  [1_5MM_R_SMD_PAD]
TP3  SINGLE_PADSMD_R15  [1_5MM_R_SMD_PAD]
U9  DNP  24AA01T-I/OT  [SOT95P270X145-5N]
XTAL2  25 MHz  CRYSTAL5X3SMT3225  [CRYSTAL-3225]

### Nets
+3V3: LED5.A ; also sheet 1,4,6,7
E_MS0: JP2.2 ; also sheet 4
E_MS1: JP3.2 ; also sheet 4
E_OSCI: C63.1 R22.2 XTAL2.3 ; also sheet 4
E_OSCO: C62.1 R22.1 XTAL2.1 ; also sheet 4
E_RSTN: C61.1 D4.1(A1) D4.2(A2) R21.1 ; also sheet 4
E_SCL: R23.1 TP2.P$1 U9.1(SCL) ; also sheet 4
E_SDA: R24.1 TP1.P$1 U9.3(SDA) ; also sheet 4
EN1P: JP4.2 ; also sheet 4
GND: C61.2 C62.2 C63.2 C64.2 JP2.3 JP3.3 JP4.3 R27.2 R28.2 R29.2 R30.2 R31.2 R32.2 R33.2 R34.2 TP3.P$1 U9.2(VSS) U9.5(WP) XTAL2.2 XTAL2.4 ; also sheet 1,2,3,4,6,7
LED3_3: R35.1 ; also sheet 4
LED6_2: JP6.1 ; also sheet 4
LED6_3: JP5.1 ; also sheet 4
LED7_0: JP9.1 ; also sheet 4
LED7_2: JP8.1 ; also sheet 4
LED7_3: JP7.1 ; also sheet 4
LED8_0: JP12.1 ; also sheet 4
LED8_2: JP11.1 ; also sheet 4
LED8_3: JP10.1 ; also sheet 4
N$23: JP2.1 JP3.1 R25.1
N$25: JP4.1 R26.1
N$26: JP5.2 R27.1
N$27: JP6.2 R28.1
N$28: JP7.2 R29.1
N$29: JP8.2 R30.1
N$30: JP9.2 R31.1
N$31: JP10.2 R32.1
N$32: JP11.2 R33.1
N$33: JP12.2 R34.1
N$34: LED5.C R35.2
VCCIO: C64.1 D4.3(CC) R21.2 R23.2 R24.2 R25.2 R26.2 U9.4(VCC) ; also sheet 4

### Notes on the sheet
- Ethernet Hub Configuration
- Optional EEPROM configuration
- External I2C EEPROM programmer connection
- Default LED Mode 0 | 802.1p disabled by default
- Radio Link/Activity | danjuliodesigns, LLC
- Hardwared configuration for non-default values
  (see KS8997 User Manual for details)
- 2

## Sheet 6 of 7
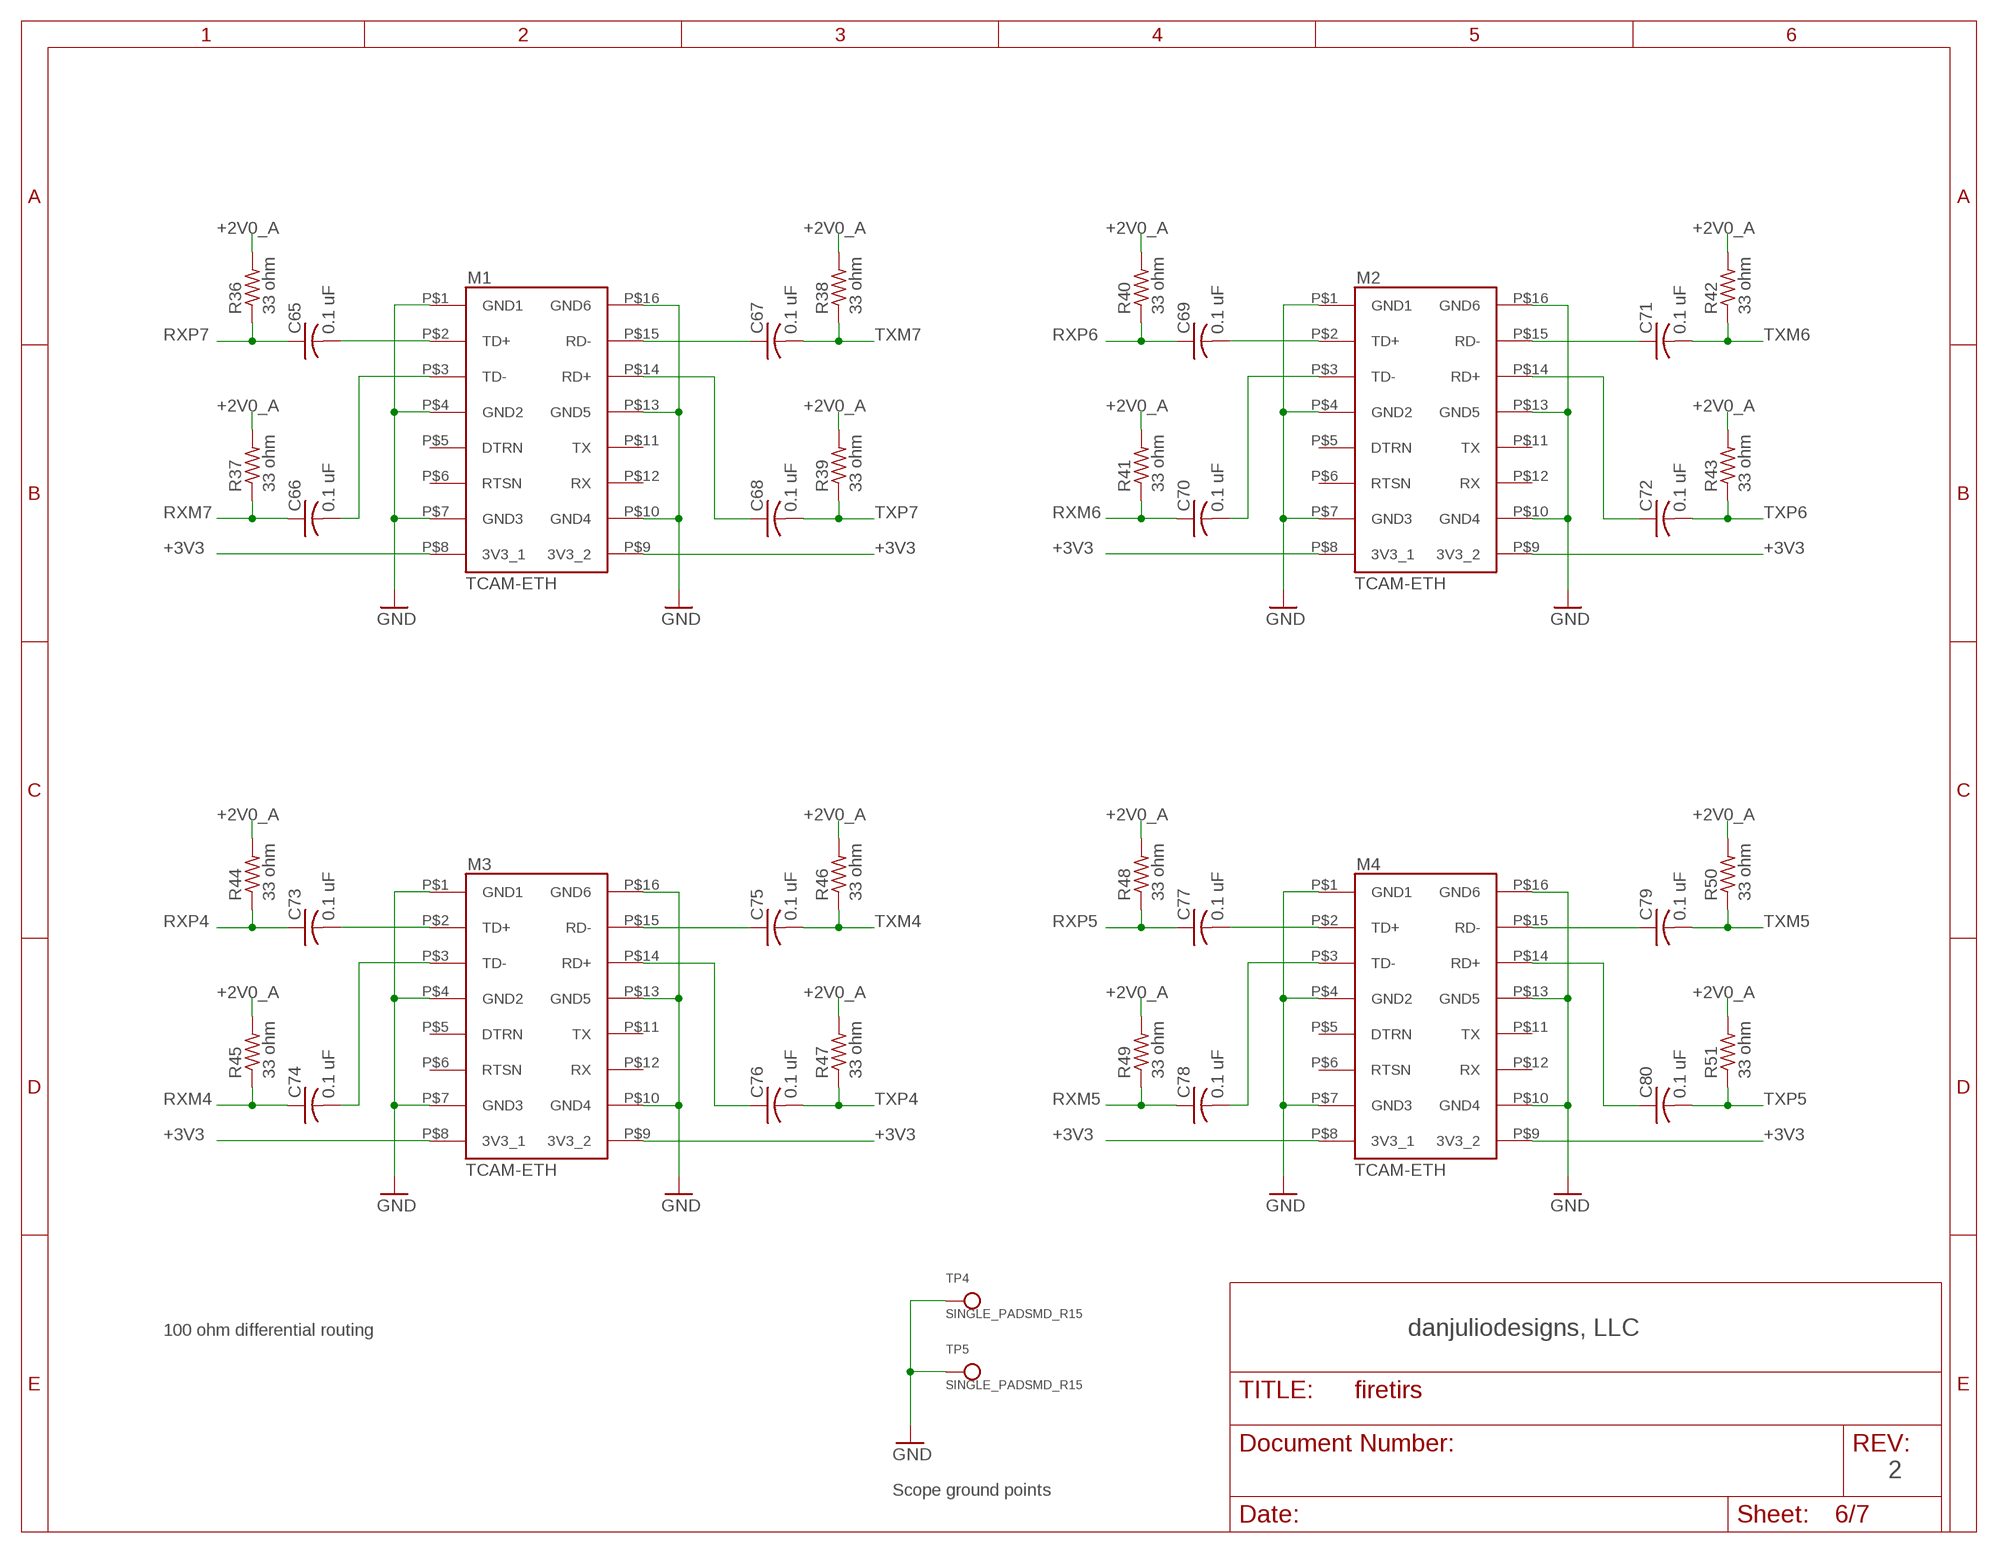
[diagram p5: schematic, sheet 6]

### Parts
C65  0.1 uF  C-USSMT0603  [C0603]
C66  0.1 uF  C-USSMT0603  [C0603]
C67  0.1 uF  C-USSMT0603  [C0603]
C68  0.1 uF  C-USSMT0603  [C0603]
C69  0.1 uF  C-USSMT0603  [C0603]
C70  0.1 uF  C-USSMT0603  [C0603]
C71  0.1 uF  C-USSMT0603  [C0603]
C72  0.1 uF  C-USSMT0603  [C0603]
C73  0.1 uF  C-USSMT0603  [C0603]
C74  0.1 uF  C-USSMT0603  [C0603]
C75  0.1 uF  C-USSMT0603  [C0603]
C76  0.1 uF  C-USSMT0603  [C0603]
C77  0.1 uF  C-USSMT0603  [C0603]
C78  0.1 uF  C-USSMT0603  [C0603]
C79  0.1 uF  C-USSMT0603  [C0603]
C80  0.1 uF  C-USSMT0603  [C0603]
M1  TCAM-ETH  [TCAM-ETH]
M2  TCAM-ETH  [TCAM-ETH]
M3  TCAM-ETH  [TCAM-ETH]
M4  TCAM-ETH  [TCAM-ETH]
R36  33 ohm  R-USSMT0603  [R0603]
R37  33 ohm  R-USSMT0603  [R0603]
R38  33 ohm  R-USSMT0603  [R0603]
R39  33 ohm  R-USSMT0603  [R0603]
R40  33 ohm  R-USSMT0603  [R0603]
R41  33 ohm  R-USSMT0603  [R0603]
R42  33 ohm  R-USSMT0603  [R0603]
R43  33 ohm  R-USSMT0603  [R0603]
R44  33 ohm  R-USSMT0603  [R0603]
R45  33 ohm  R-USSMT0603  [R0603]
R46  33 ohm  R-USSMT0603  [R0603]
R47  33 ohm  R-USSMT0603  [R0603]
R48  33 ohm  R-USSMT0603  [R0603]
R49  33 ohm  R-USSMT0603  [R0603]
R50  33 ohm  R-USSMT0603  [R0603]
R51  33 ohm  R-USSMT0603  [R0603]
TP4  SINGLE_PADSMD_R15  [1_5MM_R_SMD_PAD]
TP5  SINGLE_PADSMD_R15  [1_5MM_R_SMD_PAD]

### Nets
+2V0_A: R36.2 R37.2 R38.2 R39.2 R40.2 R41.2 R42.2 R43.2 R44.2 R45.2 R46.2 R47.2 R48.2 R49.2 R50.2 R51.2 ; also sheet 4,7
+3V3: M1.P$8(3V3_1) M1.P$9(3V3_2) M2.P$8(3V3_1) M2.P$9(3V3_2) M3.P$8(3V3_1) M3.P$9(3V3_2) M4.P$8(3V3_1) M4.P$9(3V3_2) ; also sheet 1,4,5,7
GND: M1.P$1(GND1) M1.P$4(GND2) M1.P$7(GND3) M1.P$10(GND4) M1.P$13(GND5) M1.P$16(GND6) M2.P$1(GND1) M2.P$4(GND2) M2.P$7(GND3) M2.P$10(GND4) M2.P$13(GND5) M2.P$16(GND6) M3.P$1(GND1) M3.P$4(GND2) M3.P$7(GND3) M3.P$10(GND4) M3.P$13(GND5) M3.P$16(GND6) M4.P$1(GND1) M4.P$4(GND2) M4.P$7(GND3) M4.P$10(GND4) M4.P$13(GND5) M4.P$16(GND6) TP4.P$1 TP5.P$1 ; also sheet 1,2,3,4,5,7
N$37: C70.2 M2.P$3(TD-)
N$38: C66.2 M1.P$3(TD-)
N$39: C65.2 M1.P$2(TD+)
N$41: C69.2 M2.P$2(TD+)
N$42: C71.1 M2.P$15(RD-)
N$43: C67.1 M1.P$15(RD-)
N$44: C68.1 M1.P$14(RD+)
N$46: C72.1 M2.P$14(RD+)
N$48: C74.2 M3.P$3(TD-)
N$49: C73.2 M3.P$2(TD+)
N$50: C75.1 M3.P$15(RD-)
N$51: C76.1 M3.P$14(RD+)
N$52: C78.2 M4.P$3(TD-)
N$53: C77.2 M4.P$2(TD+)
N$54: C79.1 M4.P$15(RD-)
N$55: C80.1 M4.P$14(RD+)
RXM4: C74.1 R45.1 ; also sheet 4
RXM5: C78.1 R49.1 ; also sheet 4
RXM6: C70.1 R41.1 ; also sheet 4
RXM7: C66.1 R37.1 ; also sheet 4
RXP4: C73.1 R44.1 ; also sheet 4
RXP5: C77.1 R48.1 ; also sheet 4
RXP6: C69.1 R40.1 ; also sheet 4
RXP7: C65.1 R36.1 ; also sheet 4
TXM4: C75.2 R46.1 ; also sheet 4
TXM5: C79.2 R50.1 ; also sheet 4
TXM6: C71.2 R42.1 ; also sheet 4
TXM7: C67.2 R38.1 ; also sheet 4
TXP4: C76.2 R47.1 ; also sheet 4
TXP5: C80.2 R51.1 ; also sheet 4
TXP6: C72.2 R43.1 ; also sheet 4
TXP7: C68.2 R39.1 ; also sheet 4
Unconnected: M1.P$5(DTRN) M1.P$6(RTSN) M1.P$11(TX) M1.P$12(RX) M2.P$5(DTRN) M2.P$6(RTSN) M2.P$11(TX) M2.P$12(RX) M3.P$5(DTRN) M3.P$6(RTSN) M3.P$11(TX) M3.P$12(RX) M4.P$5(DTRN) M4.P$6(RTSN) M4.P$11(TX) M4.P$12(RX)

### Notes on the sheet
- 100 ohm differential routing | danjuliodesigns, LLC
- 2
- Scope ground points

## Sheet 7 of 7
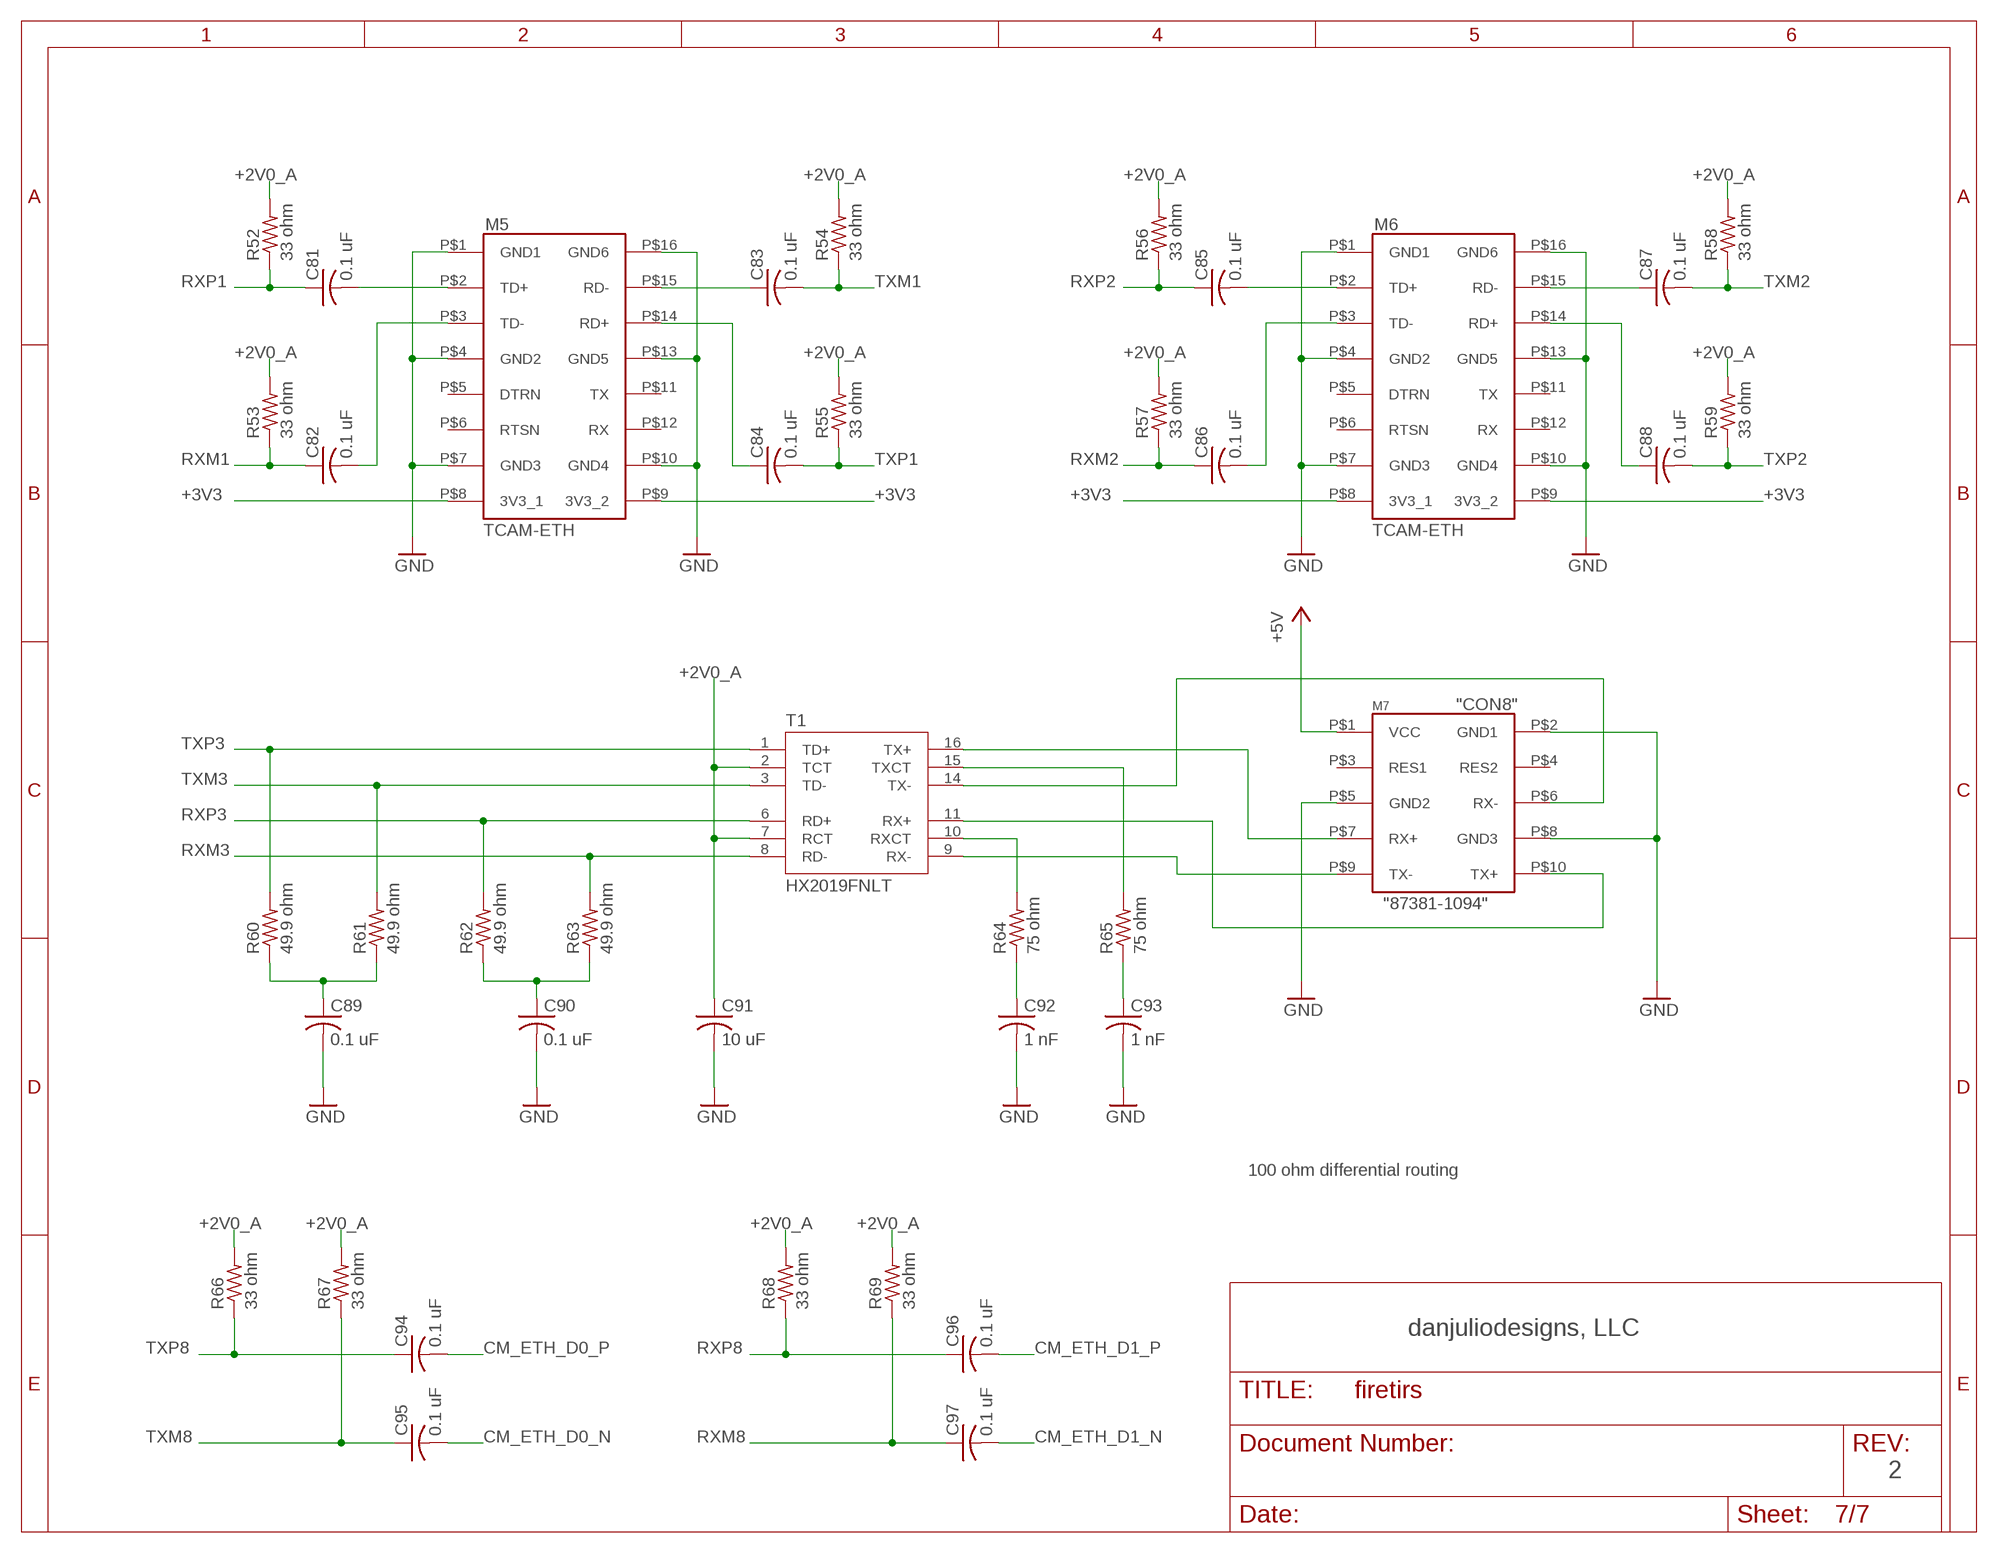
[diagram p6: schematic, sheet 7]

### Parts
C81  0.1 uF  C-USSMT0603  [C0603]
C82  0.1 uF  C-USSMT0603  [C0603]
C83  0.1 uF  C-USSMT0603  [C0603]
C84  0.1 uF  C-USSMT0603  [C0603]
C85  0.1 uF  C-USSMT0603  [C0603]
C86  0.1 uF  C-USSMT0603  [C0603]
C87  0.1 uF  C-USSMT0603  [C0603]
C88  0.1 uF  C-USSMT0603  [C0603]
C89  0.1 uF  C-USSMT0603  [C0603]
C90  0.1 uF  C-USSMT0603  [C0603]
C91  10 uF  C-USSMT0603  [C0603]
C92  1 nF  C-USSMT0603  [C0603]
C93  1 nF  C-USSMT0603  [C0603]
C94  0.1 uF  C-USSMT0603  [C0603]
C95  0.1 uF  C-USSMT0603  [C0603]
C96  0.1 uF  C-USSMT0603  [C0603]
C97  0.1 uF  C-USSMT0603  [C0603]
M5  TCAM-ETH  [TCAM-ETH]
M6  TCAM-ETH  [TCAM-ETH]
M7  FREEWAVE_Z9_PC  [FREEWAVE_Z9_PC]
R52  33 ohm  R-USSMT0603  [R0603]
R53  33 ohm  R-USSMT0603  [R0603]
R54  33 ohm  R-USSMT0603  [R0603]
R55  33 ohm  R-USSMT0603  [R0603]
R56  33 ohm  R-USSMT0603  [R0603]
R57  33 ohm  R-USSMT0603  [R0603]
R58  33 ohm  R-USSMT0603  [R0603]
R59  33 ohm  R-USSMT0603  [R0603]
R60  49.9 ohm  R-USSMT0603  [R0603]
R61  49.9 ohm  R-USSMT0603  [R0603]
R62  49.9 ohm  R-USSMT0603  [R0603]
R63  49.9 ohm  R-USSMT0603  [R0603]
R64  75 ohm  R-USSMT0603  [R0603]
R65  75 ohm  R-USSMT0603  [R0603]
R66  33 ohm  R-USSMT0603  [R0603]
R67  33 ohm  R-USSMT0603  [R0603]
R68  33 ohm  R-USSMT0603  [R0603]
R69  33 ohm  R-USSMT0603  [R0603]
T1  HX2019FNLT  [XFMR_HX2019FNLT]

### Nets
+2V0_A: C91.1 R52.2 R53.2 R54.2 R55.2 R56.2 R57.2 R58.2 R59.2 R66.2 R67.2 R68.2 R69.2 T1.2(TCT) T1.7(RCT) ; also sheet 4,6
+3V3: M5.P$8(3V3_1) M5.P$9(3V3_2) M6.P$8(3V3_1) M6.P$9(3V3_2) ; also sheet 1,4,5,6
+5V: M7.P$1(VCC) ; also sheet 1,2,3
CM_ETH_D0_N: C95.2 ; also sheet 2
CM_ETH_D0_P: C94.2 ; also sheet 2
CM_ETH_D1_N: C97.2 ; also sheet 2
CM_ETH_D1_P: C96.2 ; also sheet 2
GND: C89.2 C90.2 C91.2 C92.2 C93.2 M5.P$1(GND1) M5.P$4(GND2) M5.P$7(GND3) M5.P$10(GND4) M5.P$13(GND5) M5.P$16(GND6) M6.P$1(GND1) M6.P$4(GND2) M6.P$7(GND3) M6.P$10(GND4) M6.P$13(GND5) M6.P$16(GND6) M7.P$2(GND1) M7.P$5(GND2) M7.P$8(GND3) ; also sheet 1,2,3,4,5,6
N$56: C81.2 M5.P$2(TD+)
N$57: C82.2 M5.P$3(TD-)
N$59: C85.2 M6.P$2(TD+)
N$61: C86.2 M6.P$3(TD-)
N$62: C87.1 M6.P$15(RD-)
N$63: C83.1 M5.P$15(RD-)
N$65: C84.1 M5.P$14(RD+)
N$68: C88.1 M6.P$14(RD+)
N$75: C89.1 R60.1 R61.1
N$76: C90.1 R62.1 R63.1
N$77: C92.1 R64.1
N$78: C93.1 R65.1
N$80: R64.2 T1.10(RXCT)
N$81: R65.2 T1.15(TXCT)
N$82: M7.P$9(TX-) T1.9(RX-)
N$83: M7.P$10(TX+) T1.11(RX+)
N$84: M7.P$6(RX-) T1.14(TX-)
N$85: M7.P$7(RX+) T1.16(TX+)
RXM1: C82.1 R53.1 ; also sheet 4
RXM2: C86.1 R57.1 ; also sheet 4
RXM3: R63.2 T1.8(RD-) ; also sheet 4
RXM8: C97.1 R69.1 ; also sheet 4
RXP1: C81.1 R52.1 ; also sheet 4
RXP2: C85.1 R56.1 ; also sheet 4
RXP3: R62.2 T1.6(RD+) ; also sheet 4
RXP8: C96.1 R68.1 ; also sheet 4
TXM1: C83.2 R54.1 ; also sheet 4
TXM2: C87.2 R58.1 ; also sheet 4
TXM3: R61.2 T1.3(TD-) ; also sheet 4
TXM8: C95.1 R67.1 ; also sheet 4
TXP1: C84.2 R55.1 ; also sheet 4
TXP2: C88.2 R59.1 ; also sheet 4
TXP3: R60.2 T1.1(TD+) ; also sheet 4
TXP8: C94.1 R66.1 ; also sheet 4
Unconnected: M5.P$5(DTRN) M5.P$6(RTSN) M5.P$11(TX) M5.P$12(RX) M6.P$5(DTRN) M6.P$6(RTSN) M6.P$11(TX) M6.P$12(RX) M7.P$3(RES1) M7.P$4(RES2)

### Notes on the sheet
- "CON8"
- "87381-1094"
- 100 ohm differential routing
- danjuliodesigns, LLC
- 2

## Power pins joined to a net without a drawn wire
1.8V-OUT: CM.88(POWER:1.8V-OUT) CM.90(POWER:1.8V-OUT)

## Library data of the parts
BATT1 = djd_eagle_library:COIN_CELL
C1 C2 C5-C15 C17-C19 C21-C24 C26-C97 = djd_eagle_library:C-US
C3 C4 C16 C20 C25 = djd_eagle_library:CPOL-US
CM = CM4:RASPBERRYPI-CM4
CON1 = XT60PW-M:XT60PW-M: Check availability <https://pricing.snapeda.com/parts/XT60PW-M/AMASS/view-part?ref=eda>; AVAILABILITY: Not in stock; CHECK_PRICES: https://www.snapeda.com/parts/XT60PW-M/AMASS/view-part/?ref=eda; DESCRIPTION: Socket, DC supply, male, PIN: 2; MF: AMASS; MP: XT60PW-M; PACKAGE: Package; PRICE: None; SNAPEDA_LINK: https://www.snapeda.com/parts/XT60PW-M/AMASS/view-part/?ref=snap
CON2 = djd_eagle_library:USB
CON3 = 10029449-111RLF:10029449-111RLF: Check availability <https://pricing.snapeda.com/parts/10029449111RLF/Amphenol/view-part?ref=eda>; AVAILABILITY: In Stock; CHECK_PRICES: https://www.snapeda.com/parts/10029449111RLF/Amphenol/view-part/?ref=eda; DESCRIPTION: HDMI HDMI 1.4 Receptacle Connector 19 Position Surface Mount, Right Angle; Through Hole; MF: Amphenol; MP: 10029449111RLF; PACKAGE: None; PRICE: None; PURCHASE-URL: https://www.snapeda.com/api/url_track_click_mouser/?unipart_id=12786798&manufacturer=Amphenol&part_name=10029449111RLF&search_term=10029449-111rlf; SNAPEDA_LINK: https://www.snapeda.com/parts/10029449111RLF/Amphenol/view-part/?ref=snap
CON4 = 1-1734248-5:1-1734248-5: CONN FPC VERT 15POS 1.00MM SMD Check availability <https://pricing.snapeda.com/parts/1-1734248-5/TE%20Connectivity/view-part?ref=eda>; AVAILABILITY: In Stock; CHECK_PRICES: https://www.snapeda.com/parts/1-1734248-5/TE+Connectivity+AMP+Connectors/view-part/?ref=eda; COMMENT: 1-1734248-5; DESCRIPTION: 15 Position FPC Connector Contacts, Vertical - 1 Sided 0.039 (1.00mm) Surface Mount; MF: TE Connectivity; MP: 1-1734248-5; PACKAGE: None; PRICE: None; PURCHASE-URL: https://www.snapeda.com/api/url_track_click_mouser/?unipart_id=618488&manufacturer=TE Connectivity&part_name=1-1734248-5&search_term=1-1734248-5; SNAPEDA_LINK: https://www.snapeda.com/parts/1-1734248-5/TE+Connectivity+AMP+Connectors/view-part/?ref=snap
CON5 = SM04B-SRSS-TB_LF__SN_:SM04B-SRSS-TB(LF)(SN): SH Series 1.0 mm Pitch 2 Position Single Row Side Entry Shrouded Header Check prices <https://pricing.snapeda.com/parts/SM04B-SRSS-TB%28LF%29%28SN%29/JST%20Sales/view-part?ref=eda>; AVAILABILITY: In Stock; DESCRIPTION: Connector Header Surface Mount, Right Angle 4 position 0.039 (1.00mm); MF: JST Sales; MP: SM04B-SRSS-TB(LF)(SN); PACKAGE: None; PRICE: None; PURCHASE-URL: https://pricing.snapeda.com/search/part/SM04B-SRSS-TB(LF)(SN)/?ref=eda
CON6 = 47053-1000:47053-1000: MOLEX - 47053-1000 - HEADER, 4POS, 1ROW, 2.54MM Source: Datasheet <http://www.molex.com/pdm_docs/sd/470531000_sd.pdf> Check availability <https://pricing.snapeda.com/parts/47053-1000/Molex/view-part?ref=eda>; AVAILABILITY: In Stock; CHECK_PRICES: https://www.snapeda.com/parts/47053-1000/Molex/view-part/?ref=eda; DESCRIPTION: Conn.; Rect./PCB; Header; 4 Cir.; Vert.; with Friction Lock; KK 254 Series | Molex Incorporated 47053-1000; MF: Molex; MP: 47053-1000; PACKAGE: None; PRICE: None; SNAPEDA_LINK: https://www.snapeda.com/parts/47053-1000/Molex/view-part/?ref=snap
CON7 = con-JST PH:B2B-PH: JST PH series header 2.00mm pitch disconnectable crimp style connectors, vertical (side entry type), 2 pins
D1 = djd_eagle_library:DIODE
D2 = djd_eagle_library:ZENER_DIODE
D3 D4 = diode:BAT54C: Schottky Diodes Source: Fairchild .. BAT54.pdf
F1 = djd_eagle_library:FUSE_2IO: Fuses with 2 pins per terminal
J1 = SparkFun-Connectors:M06X2; PROD_ID: CONN-12423
J2 = SparkFun-Connectors:M03: Header 3 Standard 3-pin 0.1" header. Use with straight break away headers (SKU : PRT-00116), right angle break away headers (PRT-00553), swiss pins (PRT-00743), machine pins (PRT-00117), and female headers (PRT-00115). Molex polarized connector foot print use with SKU : PRT-08232 with associated crimp pins and housings.
J3 = SparkFun-Connectors:M06: Header 6 Standard 6-pin 0.1" header. Use with straight break away headers (SKU : PRT-00116), right angle break away headers (PRT-00553), swiss pins (PRT-00743), machine pins (PRT-00117), and female headers (PRT-00115). Molex polarized connector foot print use with SKU : PRT-08094 with associated crimp pins and housings. NOTES ON THE VARIANTS LOCK and LOCK_LONGPADS... This footprint was designed to help hold the alignment of a through-hole component (i.e. 6-pin header) while soldering it into place. You may notice that each hole has been shifted either up or down by 0.005 of an inch from it's more standard position (which is a perfectly straight line). This slight alteration caused the pins (the squares in the middle) to touch the edges of the holes. Because they are alternating, it causes a "brace" to hold the component in place. 0.005 has proven to be the perfect amount of "off-center" position when using our standard breakaway headers. Although looks a little odd when you look at the bare footprint, once you have a header in there, the alteration is very hard to notice. Also,if you push a header all the way into place, it is covered up entirely on the bottom side. This idea of altering the position of holes to aid alignment will be further integrated into the Sparkfun Library for other footprints. It can help hold any component with 3 or more connection pins.; PROD_ID: CONN-08437
JP1-JP4 = SparkFun-Passives:JUMPER-PAD-3-2OF3_NC_BY_TRACE
JP5-JP12 = SparkFun-Passives:JUMPER-PAD-2-NO
L1-L3 = djd_eagle_library:INDUCTOR
LED1-LED5 = led:LED: LED OSRAM: - CHIPLED LG R971, LG N971, LY N971, LG Q971, LY Q971, LO R971, LY R971 LH N974, LH R974 LS Q976, LO Q976, LY Q976 LO Q996 - Hyper CHIPLED LW Q18S LB Q993, LB Q99A, LB R99A - SideLED LS A670, LO A670, LY A670, LG A670, LP A670 LB A673, LV A673, LT A673, LW A673 LH A674 LY A675 LS A676, LA A676, LO A676, LY A676, LW A676 LS A679, LY A679, LG A679 - Hyper Micro SIDELED® LS Y876, LA Y876, LO Y876, LY Y876 LT Y87S - SmartLED LW L88C, LW L88S LB L89C, LB L89S, LG L890 LS L89K, LO L89K, LY L89K LS L896, LA L896, LO L896, LY L896 - TOPLED LS T670, LO T670, LY T670, LG T670, LP T670 LSG T670, LSP T670, LSY T670, LOP T670, LYG T670 LG T671, LOG T671, LSG T671 LB T673, LV T673, LT T673, LW T673 LH T674 LS T676, LA T676, LO T676, LY T676, LB T676, LH T676, LSB T676, LW T676 LB T67C, LV T67C, LT T67C, LS T67K, LO T67K, LY T67K, LW E67C LS E67B, LA E67B, LO E67B, LY E67B, LB E67C, LV E67C, LT E67C LW T67C LS T679, LY T679, LG T679 LS T770, LO T770, LY T770, LG T770, LP T770 LB T773, LV T773, LT T773, LW T773 LH T774 LS E675, LA E675, LY E675, LS T675 LS T776, LA T776, LO T776, LY T776, LB T776 LHGB T686 LT T68C, LB T68C - Hyper Mini TOPLED® LB M676 - Mini TOPLED Santana® LG M470 LS M47K, LO M47K, LY M47K Source: http://www.osram.convergy.de LUXEON: - LUMILED® LXK2-PW12-R00, LXK2-PW12-S00, LXK2-PW14-U00, LXK2-PW14-V00 LXK2-PM12-R00, LXK2-PM12-S00, LXK2-PM14-U00 LXK2-PE12-Q00, LXK2-PE12-R00, LXK2-PE12-S00, LXK2-PE14-T00, LXK2-PE14-U00 LXK2-PB12-K00, LXK2-PB12-L00, LXK2-PB12-M00, LXK2-PB14-N00, LXK2-PB14-P00, LXK2-PB14-Q00 LXK2-PR12-L00, LXK2-PR12-M00, LXK2-PR14-Q00, LXK2-PR14-R00 LXK2-PD12-Q00, LXK2-PD12-R00, LXK2-PD12-S00 LXK2-PH12-R00, LXK2-PH12-S00 LXK2-PL12-P00, LXK2-PL12-Q00, LXK2-PL12-R00 Source: www.luxeon.com KINGBRIGHT: KA-3528ASYC Source: www.kingbright.com
M1-M6 = djd_eagle_library:TCAM-ETH
M7 = djd_eagle_library:FREEWAVE_Z9_PC: Freewave Z9-PC radio module
PS1 PS2 = RPX-4.0-CT:RPX-4.0-CT: 4.0 Amp QFN Package. Check availability <https://pricing.snapeda.com/parts/RPX-4.0-CT/Recom%20Power/view-part?ref=eda>; AVAILABILITY: In Stock; CHECK_PRICES: https://www.snapeda.com/parts/RPX-4.0-CT/Recom+Power/view-part/?ref=eda; DESCRIPTION: Non-Isolated PoL Module DC DC Converter 1 Output 1 ~ 7V - - - 4A 3.8V - 36V Input; MF: Recom Power; MP: RPX-4.0-CT; PACKAGE: PowerBQFN-15 Recom Power; PRICE: None; PURCHASE-URL: https://www.snapeda.com/api/url_track_click_mouser/?unipart_id=6186596&manufacturer=Recom Power&part_name=RPX-4.0-CT&search_term=rpx-4.0; SNAPEDA_LINK: https://www.snapeda.com/parts/RPX-4.0-CT/Recom+Power/view-part/?ref=snap
Q1 = djd_eagle_library:MOSFET_PCHANNEL_SO8: P-channel MOSFET in SOIC-8 package
R1-R70 = djd_eagle_library:R-US
S1 = DM3CS-SF:DM3CS-SF: CONN MICRO SD CARD HINGED TYPE Check availability <https://pricing.snapeda.com/parts/DM3CS-SF/Hirose/view-part?ref=eda>; AVAILABILITY: In Stock; CHECK_PRICES: https://www.snapeda.com/parts/DM3CS-SF/Hirose+Electric+Co+Ltd/view-part/?ref=eda; DESCRIPTION: 10 (8 + 2) Position Card Connector Secure Digital - microSD™ Surface Mount, Right Angle Gold; MF: Hirose; MP: DM3CS-SF; PACKAGE: None; PRICE: None; PURCHASE-URL: https://www.snapeda.com/api/url_track_click_mouser/?unipart_id=189585&manufacturer=Hirose&part_name=DM3CS-SF&search_term= dm3cs-sf; SNAPEDA_LINK: https://www.snapeda.com/parts/DM3CS-SF/Hirose+Electric+Co+Ltd/view-part/?ref=snap
SW1 = djd_eagle_library:SPDT
T1 = HX2019FNLT:HX2019FNLT: 350µH LAN 10/100 Base-T Pulse Transformer 1CT:1CT Transmitter, 1CT:1CT Receiver Surface Mount Check availability <https://pricing.snapeda.com/parts/HX2019FNL/Pulse/view-part?ref=eda>; AVAILABILITY: In Stock; DESCRIPTION: 350µH LAN 10/100 Base-T Pulse Transformer 1CT:1CT Transmitter, 1CT:1CT Receiver Surface Mount; MF: Pulse; MP: HX2019FNL; PACKAGE: None; PRICE: None; PURCHASE-URL: https://pricing.snapeda.com/search/part/HX2019FNL/?ref=eda
TP1-TP5 = djd_eagle_library:SINGLE_PAD
U1 = djd_eagle_library:AP7363: Diodes Inc 1.5A Low Quiescent current adjustable LDO
U2 U3 = RT9742GGJ5:RT9742GGJ5: Check availability <https://pricing.snapeda.com/parts/RT9742GGJ5/Richtek%20USA%20Inc./view-part?ref=eda>; AVAILABILITY: In Stock; CHECK_PRICES: https://www.snapeda.com/parts/RT9742GGJ5/Richtek+USA+Inc./view-part/?ref=eda; DESCRIPTION: Power Switch/Driver 1:1 N-Channel 1A TSOT-23-5; MF: Richtek USA Inc.; MP: RT9742GGJ5; PACKAGE: SOT-23-5 Richtek USA Inc.; PRICE: None; PURCHASE-URL: https://www.snapeda.com/api/url_track_click_mouser/?unipart_id=7353032&manufacturer=Richtek USA Inc.&part_name=RT9742GGJ5&search_term=rt9742; SNAPEDA_LINK: https://www.snapeda.com/parts/RT9742GGJ5/Richtek+USA+Inc./view-part/?ref=snap
U4 = SP3002-04JTG:SP3002-04JTG: SP3002 Series 13 V 0.85 pF Low Capacitance ESD Protection Array - SC-70-6 Check availability <https://pricing.snapeda.com/parts/SP3002-04JTG/Littelfuse%20Inc./view-part?ref=eda>; AVAILABILITY: In Stock; DESCRIPTION: 13V Clamp 4.5A (8/20µs) Ipp Tvs Diode Surface Mount SC-70-6; MF: Littelfuse Inc.; MP: SP3002-04JTG; PACKAGE: SC-70-6 Littelfuse; PRICE: None; PURCHASE-URL: https://pricing.snapeda.com/search/part/SP3002-04JTG/?ref=eda
U5 = djd_eagle_library:RT9742_3TERM: Richtek RT9742 3-terminal load switch
U6 = djd_eagle_library:PCF85063AT: NXP Semiconductor 8-pin RTC
U7 = djd_eagle_library:EMC2301: SMSC RPM-based fan controller
U8 = KS8997:KS8997: 8-Port 10/100 Integrated Switch Check availability <https://pricing.snapeda.com/parts/KS8997/Micrel/view-part?ref=eda>; AVAILABILITY: Not in stock; CHECK_PRICES: https://www.snapeda.com/parts/KS8997/Micrel/view-part/?ref=eda; DESCRIPTION: Interface ICs, fast, switch, Semiconductors and Actives, Ethernet, ic; MF: Micrel; MP: KS8997; PACKAGE: PQFP-128 Micrel; PRICE: None; SNAPEDA_LINK: https://www.snapeda.com/parts/KS8997/Micrel/view-part/?ref=snap
U9 = Microchip_By_element14_Batch_1:24AA01T-I/OT: EEPROM; DESCRIPTION: Serial EEPROM; MPN: 24AA01T-I/OT; OC_FARNELL: 1331269; OC_NEWARK: 72C4376; PACKAGE: SOT-5; SUPPLIER: Microchip
XTAL1 = djd_eagle_library:CRYSTAL: 2-pin crystal
XTAL2 = djd_eagle_library:CRYSTAL5X3